# EasyEDA Pro project EMG_frontend.eprj, board PCB1
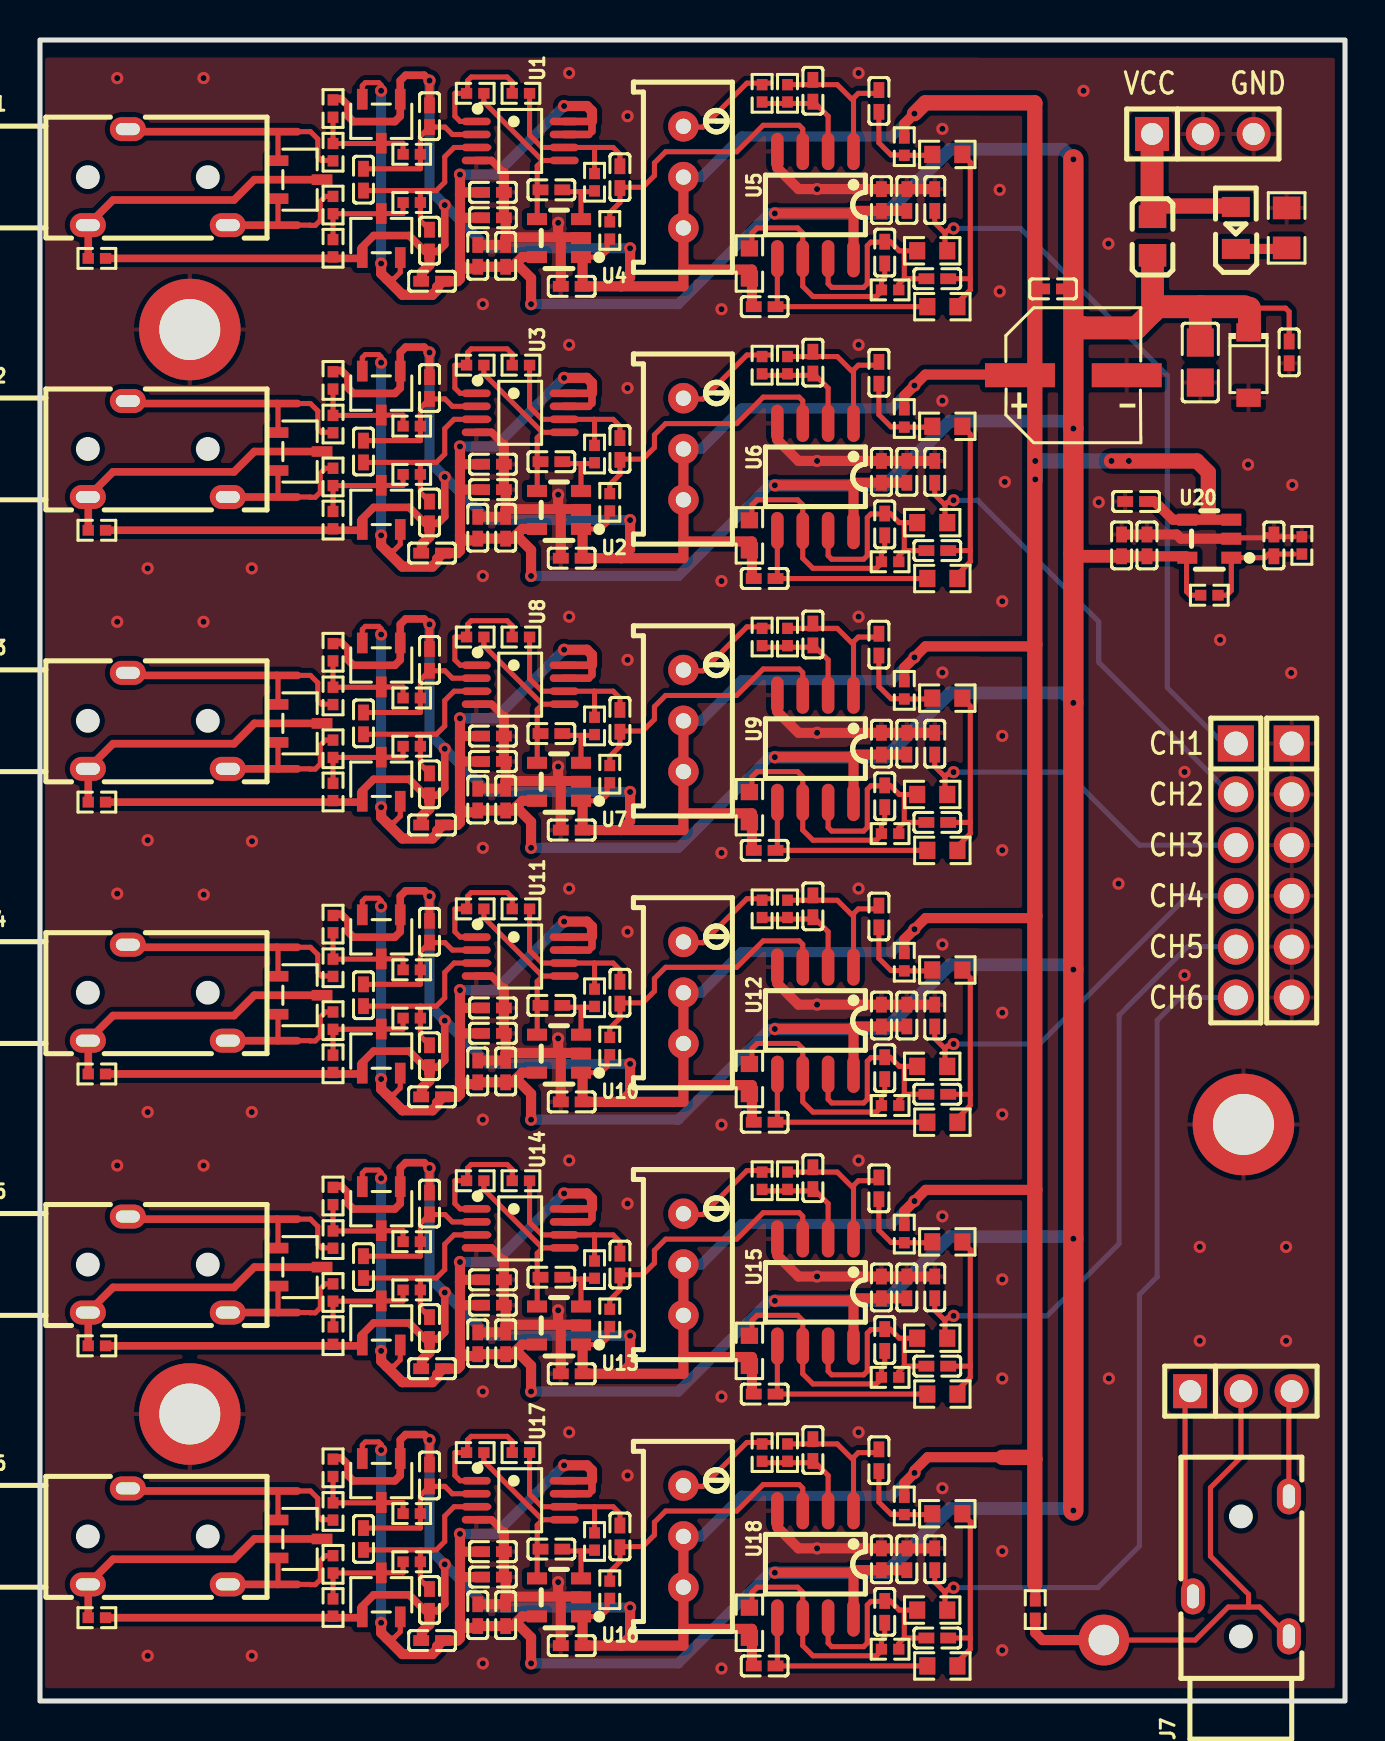
[diagram p2: board, top side]
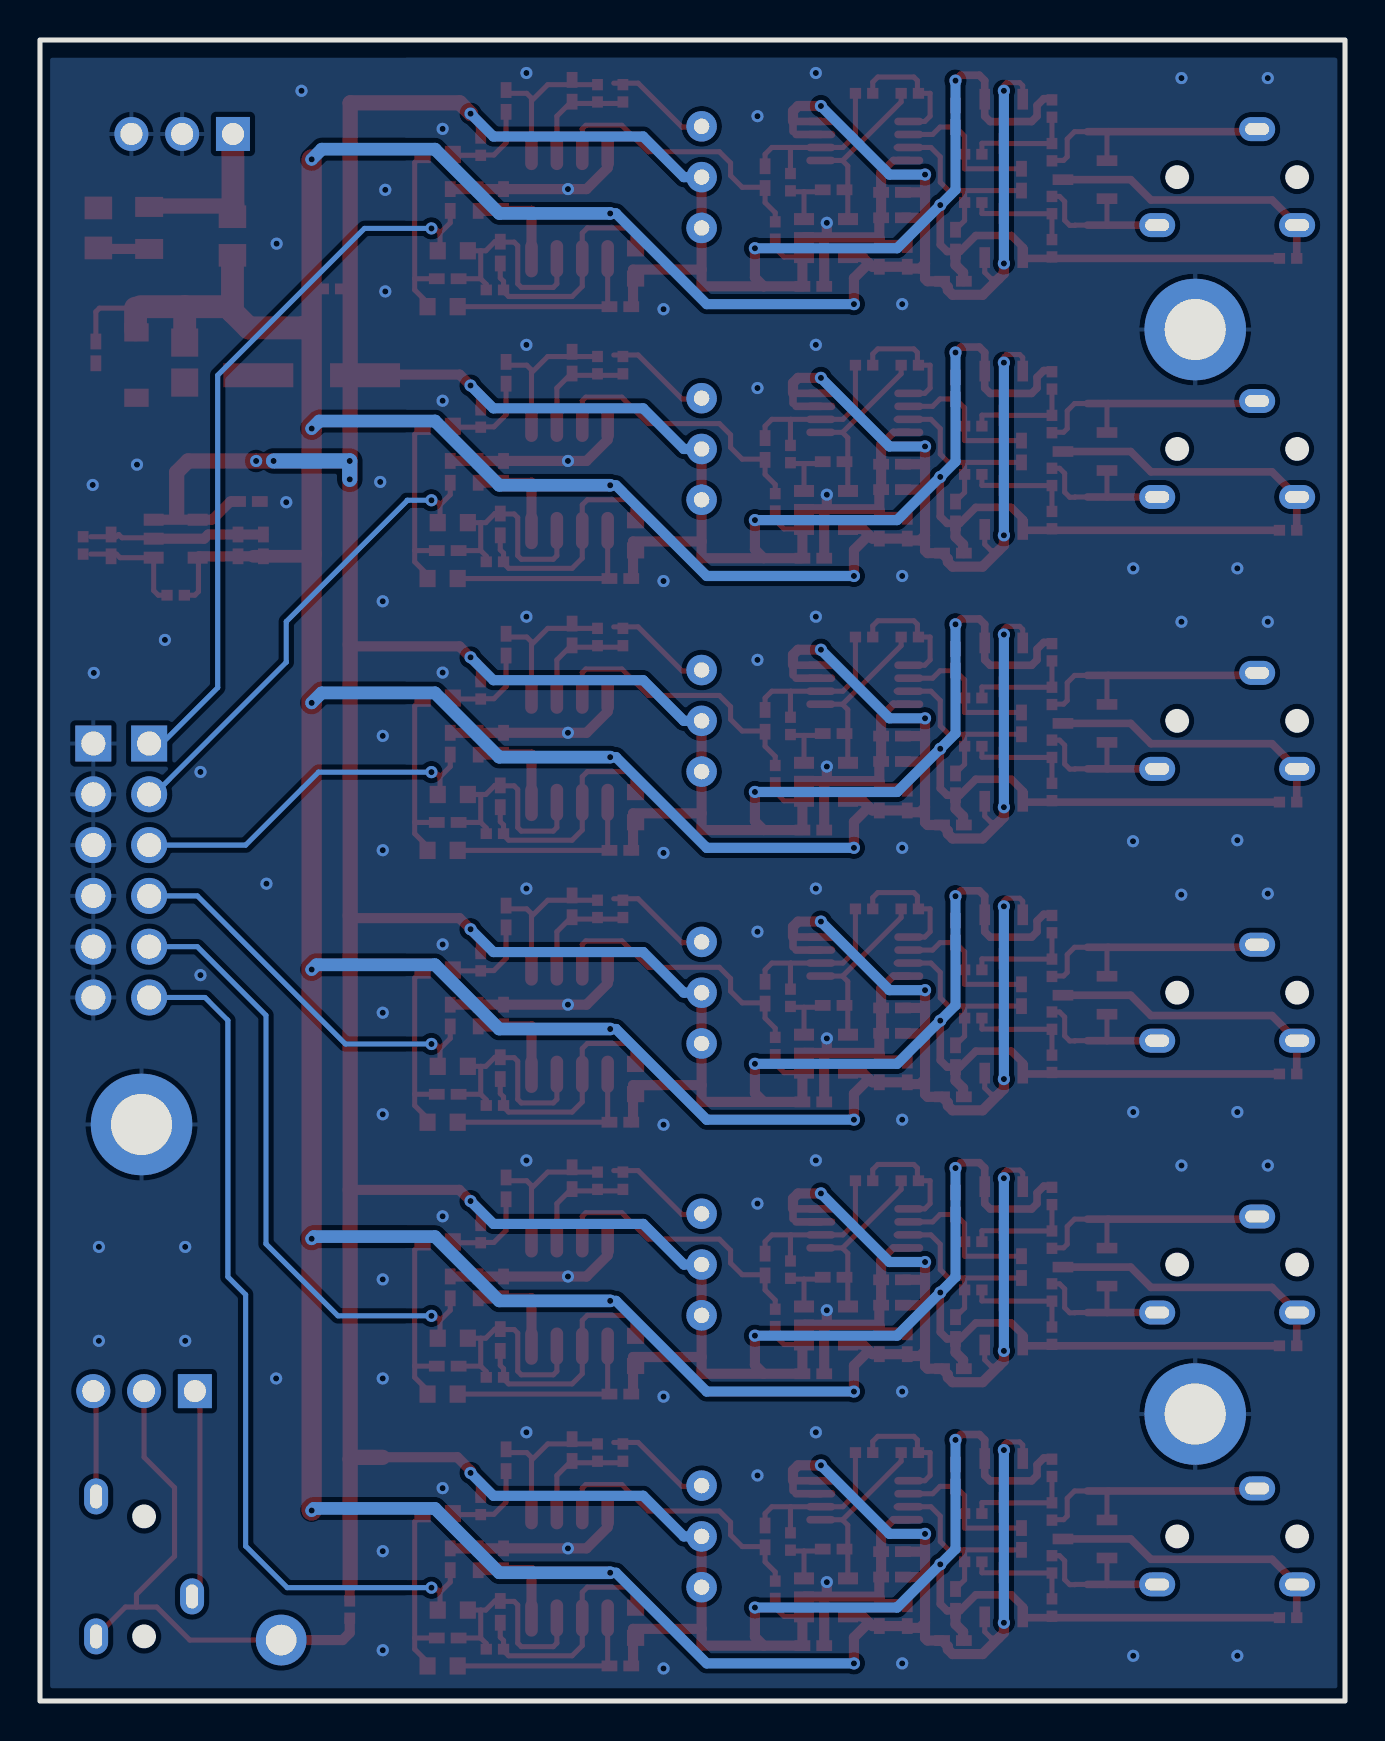
[diagram p3: board, bottom side, seen from below]

Outline 65.28 x 83.06 mm; copper layers: Top Layer, Bottom Layer. Coordinates in mm from the lower left corner of the outline.
Outline path: rectangle 0,83.06 65.28,0
Stack: Top Layer 0.035mm / Dielectric1 1.51mm FR4 er 4.5 / Bottom Layer 0.035mm

## Design rules (mm)
template: JLCPCB Capability(Two Layers Board)
spacing copperThickness1oz (default): track to track 0.102, other pairs 0.152 to 0.3
spacing copperThickness2oz: track to track 0.203, other pairs 0.152 to 0.3
track width copperThickness1oz (default): min 0.127, default 0.254, max 2.54
track width copperThickness2oz: min 0.203, default 0.254, max 2.54
differential pair differentialPair (default): width min 0.127, default 0.254, max 2.54; gap min 0.152, default 0.152
via viaSize (default): diameter min 0.5, default 0.61, max 10; hole min 0.3, default 0.305, max 6.3

## Placement (name value [footprint] x y rotation side)
C1  1uF  [C0402]  25.58 75.57 0 top
C2  1uF  [C0402]  22.66 74.17 0 top
C3  100nF  [C0402]  22.66 75.44 0 top
C4  1uF  [C0402]  23.29 72.26 90 top
C5  100nF  [C0402]  21.9 72.26 90 top
C6  1uF  [C0402]  29.01 76.2 270 top
C7  1uF  [C0402]  41.96 80.01 270 top
C8  1nF  [C0402]  38.66 80.52 90 top
C9  1uF  [C0402]  42.09 75.06 90 top
C10  100nF  [C0402]  43.36 75.06 90 top
C11  10nF  [C0402]  44.88 71.12 180 top
C12  10nF  [C0402]  36.25 69.72 0 top
C13  1nF  [C0402]  42.25 72.43 90 top
C14  1uF  [C0402]  44.76 75.06 270 top
C15  10nF  [C0402]  16.18 76.07 90 top
C16  100pF  [C0402]  19.48 73.03 270 top
C17  100pF  [C0402]  19.48 79.25 270 top
C18  100nF  [C0402]  26.6 70.74 0 top
C19  100nF  [C0402]  19.61 70.99 180 top
C20  1uF  [C0402]  25.58 61.97 0 top
C21  1uF  [C0402]  23.29 58.67 90 top
C22  100nF  [C0402]  21.9 58.67 90 top
C23  1uF  [C0402]  41.96 66.42 270 top
C24  100nF  [C0402]  22.66 61.84 0 top
C25  1uF  [C0402]  22.66 60.57 0 top
C26  1uF  [C0402]  29.01 62.61 270 top
C27  1nF  [C0402]  38.66 66.92 90 top
C28  1uF  [C0402]  42.09 61.46 90 top
C29  100nF  [C0402]  43.36 61.46 90 top
C30  10nF  [C0402]  44.88 57.53 180 top
C31  10nF  [C0402]  36.25 56.13 0 top
C32  1nF  [C0402]  42.25 58.83 90 top
C33  1uF  [C0402]  44.76 61.46 270 top
C34  10nF  [C0402]  16.18 62.48 90 top
C35  100pF  [C0402]  19.48 59.43 270 top
C36  100pF  [C0402]  19.48 65.65 270 top
C37  100nF  [C0402]  26.6 57.15 0 top
C38  100nF  [C0402]  19.61 57.4 180 top
C39  1uF  [C0402]  25.58 48.38 0 top
C40  1uF  [C0402]  23.29 45.08 90 top
C41  100nF  [C0402]  21.9 45.08 90 top
C42  1uF  [C0402]  41.96 52.82 270 top
C43  100nF  [C0402]  22.66 48.25 0 top
C44  1uF  [C0402]  22.66 46.98 0 top
C45  1uF  [C0402]  29.01 49.01 270 top
C46  1nF  [C0402]  38.66 53.33 90 top
C47  1uF  [C0402]  42.09 47.87 90 top
C48  100nF  [C0402]  43.36 47.87 90 top
C49  10nF  [C0402]  44.88 43.93 180 top
C50  10nF  [C0402]  36.25 42.54 0 top
C51  1nF  [C0402]  42.25 45.24 90 top
C52  1uF  [C0402]  44.76 47.87 270 top
C53  10nF  [C0402]  16.18 48.89 90 top
C54  100pF  [C0402]  19.48 45.84 270 top
C55  100pF  [C0402]  19.48 52.06 270 top
C56  100nF  [C0402]  26.6 43.55 0 top
C57  100nF  [C0402]  19.61 43.81 180 top
C58  1uF  [C0402]  25.58 34.78 0 top
C59  1uF  [C0402]  23.29 31.48 90 top
C60  100nF  [C0402]  21.9 31.48 90 top
C61  1uF  [C0402]  41.96 39.23 270 top
C62  100nF  [C0402]  22.66 34.66 0 top
C63  1uF  [C0402]  22.66 33.39 0 top
C64  1uF  [C0402]  29.01 35.42 270 top
C65  1nF  [C0402]  38.66 39.74 90 top
C66  1uF  [C0402]  42.09 34.28 90 top
C67  100nF  [C0402]  43.36 34.28 90 top
C68  10nF  [C0402]  44.88 30.34 180 top
C69  10nF  [C0402]  36.25 28.94 0 top
C70  1nF  [C0402]  42.25 31.65 90 top
C71  1uF  [C0402]  44.76 34.28 270 top
C72  10nF  [C0402]  16.18 35.29 90 top
C73  100pF  [C0402]  19.48 32.24 270 top
C74  100pF  [C0402]  19.48 38.47 270 top
C75  100nF  [C0402]  26.6 29.96 0 top
C76  100nF  [C0402]  19.61 30.21 180 top
C77  1uF  [C0402]  25.58 21.19 0 top
C78  1uF  [C0402]  23.29 17.89 90 top
C79  100nF  [C0402]  21.9 17.89 90 top
C80  1uF  [C0402]  41.96 25.63 270 top
C81  100nF  [C0402]  22.66 21.06 0 top
C82  1uF  [C0402]  22.66 19.79 0 top
C83  1uF  [C0402]  29.01 21.82 270 top
C84  1nF  [C0402]  38.66 26.14 90 top
C85  1uF  [C0402]  42.09 20.68 90 top
C86  100nF  [C0402]  43.36 20.68 90 top
C87  10nF  [C0402]  44.88 16.74 180 top
C88  10nF  [C0402]  36.25 15.35 0 top
C89  1nF  [C0402]  42.25 18.05 90 top
C90  1uF  [C0402]  44.76 20.68 270 top
C91  10nF  [C0402]  16.18 21.7 90 top
C92  100pF  [C0402]  19.48 18.65 270 top
C93  100pF  [C0402]  19.48 24.87 270 top
C94  100nF  [C0402]  26.6 16.36 0 top
C95  100nF  [C0402]  19.61 16.62 180 top
C96  1uF  [C0402]  25.58 7.59 0 top
C97  1uF  [C0402]  23.29 4.29 90 top
C98  100nF  [C0402]  21.9 4.29 90 top
C99  1uF  [C0402]  41.96 12.04 270 top
C100  100nF  [C0402]  22.66 7.47 0 top
C101  1uF  [C0402]  22.66 6.2 0 top
C102  1uF  [C0402]  29.01 8.23 270 top
C103  1nF  [C0402]  38.66 12.55 90 top
C104  1uF  [C0402]  42.09 7.09 90 top
C105  100nF  [C0402]  43.36 7.09 90 top
C106  10nF  [C0402]  44.88 3.15 180 top
C107  10nF  [C0402]  36.25 1.75 0 top
C108  1nF  [C0402]  42.25 4.46 90 top
C109  1uF  [C0402]  44.76 7.09 270 top
C110  10nF  [C0402]  16.18 8.1 90 top
C111  100pF  [C0402]  19.48 5.05 270 top
C112  100pF  [C0402]  19.48 11.28 270 top
C113  100nF  [C0402]  26.6 2.77 0 top
C114  100nF  [C0402]  19.61 3.02 180 top
C116  1uF  [C0402]  55.37 57.78 90 top
C117  100nF  [C0402]  54.1 57.78 90 top
C119  100nF  [C0402]  50.67 70.61 0 top
C120  100nF  [C0402]  54.83 59.98 180 top
C121  47uF  [CAP-SMD_BD6.3-L6.6-W6.6-LS7.6-FD]  51.69 66.29 0 top
C122  10nF  [C0402]  61.72 57.78 270 top
C123  10uF  [C0805]  58.04 66.93 90 top
C124  100nF  [C0402]  62.48 67.44 90 top
D1  PSM712-LF-T7  [SOT-23-3_L3.0-W1.7-P0.95-LS2.9-BR]  13.01 76.07 180 top
D3  BAV70  [SOT-23-3_L3.0-W1.7-P0.95-LS2.9-BR]  17.07 78.99 90 top
D4  BAV70  [SOT-23-3_L3.0-W1.7-P0.95-LS2.9-BR]  17.07 73.28 270 top
D5  PSM712-LF-T7  [SOT-23-3_L3.0-W1.7-P0.95-LS2.9-BR]  13.01 62.48 180 top
D7  BAV70  [SOT-23-3_L3.0-W1.7-P0.95-LS2.9-BR]  17.07 65.4 90 top
D8  BAV70  [SOT-23-3_L3.0-W1.7-P0.95-LS2.9-BR]  17.07 59.69 270 top
D9  PSM712-LF-T7  [SOT-23-3_L3.0-W1.7-P0.95-LS2.9-BR]  13.01 48.89 180 top
D11  BAV70  [SOT-23-3_L3.0-W1.7-P0.95-LS2.9-BR]  17.07 51.81 90 top
D12  BAV70  [SOT-23-3_L3.0-W1.7-P0.95-LS2.9-BR]  17.07 46.09 270 top
D13  PSM712-LF-T7  [SOT-23-3_L3.0-W1.7-P0.95-LS2.9-BR]  13.01 35.29 180 top
D15  BAV70  [SOT-23-3_L3.0-W1.7-P0.95-LS2.9-BR]  17.07 38.21 90 top
D16  BAV70  [SOT-23-3_L3.0-W1.7-P0.95-LS2.9-BR]  17.07 32.5 270 top
D17  PSM712-LF-T7  [SOT-23-3_L3.0-W1.7-P0.95-LS2.9-BR]  13.01 21.7 180 top
D19  BAV70  [SOT-23-3_L3.0-W1.7-P0.95-LS2.9-BR]  17.07 24.62 90 top
D20  BAV70  [SOT-23-3_L3.0-W1.7-P0.95-LS2.9-BR]  17.07 18.9 270 top
D21  PSM712-LF-T7  [SOT-23-3_L3.0-W1.7-P0.95-LS2.9-BR]  13.01 8.1 180 top
D23  BAV70  [SOT-23-3_L3.0-W1.7-P0.95-LS2.9-BR]  17.07 11.02 90 top
D24  BAV70  [SOT-23-3_L3.0-W1.7-P0.95-LS2.9-BR]  17.07 5.31 270 top
H1  2.54-1x6P直针  [HDR-TH_6P-P2.54-V-M-1]  59.82 41.53 270 top
H2  2.54-1x6P直针  [HDR-TH_6P-P2.54-V-M-1]  62.61 41.53 270 top
H3  PZ254V-11-03P  [HDR-TH_3P-P2.54-V-M]  58.17 78.36 0 top
H4  PZ254V-11-03P  [HDR-TH_3P-P2.54-V-M]  60.07 15.49 0 top
J1  320B直插  [AUDIO-TH_PJ-3200]  5.9 76.2 0 top
J2  320B直插  [AUDIO-TH_PJ-3200]  5.9 62.61 0 top
J3  320B直插  [AUDIO-TH_PJ-3200]  5.9 49.01 0 top
J4  320B直插  [AUDIO-TH_PJ-3200]  5.9 35.42 0 top
J5  320B直插  [AUDIO-TH_PJ-3200]  5.9 21.82 0 top
J6  320B直插  [AUDIO-TH_PJ-3200]  5.9 8.23 0 top
J7  320B直插  [AUDIO-TH_PJ-3200]  60.07 6.73 90 top
L1  10uH  [L0805]  55.65 73.25 90 top
LED1  NCD0805R1  [LED0805-R-RD]  59.82 73.66 90 top
NOREF  -  [Pad_e625]  7.49 68.58 0 top
NOREF#2  -  [Pad_e620]  7.49 14.35 0 top
NOREF#3  -  [Pad_e358]  53.21 3.05 0 top
NOREF#4  -  [Pad_e411]  60.2 28.83 0 top
R1  10kΩ  [R0402]  21.77 80.39 0 top
R2  10kΩ  [R0402]  24.06 80.39 180 top
R3  100kΩ  [R0402]  27.74 75.95 90 top
R4  100kΩ  [R0402]  28.5 73.53 90 top
R5  100kΩ  [R0402]  43.23 77.72 270 top
R6  20kΩ  [RES-ADJ-TH_3P-L9.5-W4.85-P2.54_PV36W103C01B00]  32.18 76.2 0 top
R7  1kΩ  [R0402]  36.12 80.39 270 top
R8  100kΩ  [R0402]  37.39 80.39 90 top
R9  56kΩ  [R0603]  45.38 77.33 0 top
R10  330kΩ  [R0603]  45.14 69.72 180 top
R11  3.9kΩ  [R0603]  35.49 71.88 90 top
R12  10kΩ  [R0402]  42.52 70.56 180 top
R13  3.9kΩ  [R0603]  44.63 72.52 0 top
R14  100kΩ  [R0402]  27.74 62.35 90 top
R15  10kΩ  [R0402]  24.06 66.8 180 top
R16  100kΩ  [R0402]  43.23 64.13 270 top
R17  100kΩ  [R0402]  28.5 59.94 90 top
R18  10kΩ  [R0402]  21.77 66.8 0 top
R19  1MΩ  [R0402]  14.66 79.63 90 top
R20  1MΩ  [R0402]  14.66 72.64 90 top
R21  2kΩ  [R0402]  14.66 77.45 90 top
R22  2kΩ  [R0402]  2.85 72.14 0 top
R23  2kΩ  [R0402]  14.66 74.8 270 top
R24  2kΩ  [R0402]  18.59 74.93 0 top
R25  2kΩ  [R0402]  18.59 77.34 0 top
R26  20kΩ  [RES-ADJ-TH_3P-L9.5-W4.85-P2.54_PV36W103C01B00]  32.18 62.61 0 top
R27  1kΩ  [R0402]  36.12 66.8 270 top
R28  100kΩ  [R0402]  37.39 66.8 90 top
R29  56kΩ  [R0603]  45.38 63.74 0 top
R30  330kΩ  [R0603]  45.14 56.13 180 top
R31  3.9kΩ  [R0603]  35.49 58.29 90 top
R32  10kΩ  [R0402]  42.52 56.97 180 top
R33  3.9kΩ  [R0603]  44.63 58.92 0 top
R34  1MΩ  [R0402]  14.66 66.04 90 top
R35  1MΩ  [R0402]  14.66 59.05 90 top
R36  2kΩ  [R0402]  14.66 63.85 90 top
R37  2kΩ  [R0402]  2.85 58.54 0 top
R38  2kΩ  [R0402]  14.66 61.21 270 top
R39  2kΩ  [R0402]  18.59 61.34 0 top
R40  2kΩ  [R0402]  18.59 63.75 0 top
R41  100kΩ  [R0402]  27.74 48.76 90 top
R42  10kΩ  [R0402]  24.06 53.2 180 top
R43  100kΩ  [R0402]  43.23 50.54 270 top
R44  100kΩ  [R0402]  28.5 46.35 90 top
R45  10kΩ  [R0402]  21.77 53.2 0 top
R46  20kΩ  [RES-ADJ-TH_3P-L9.5-W4.85-P2.54_PV36W103C01B00]  32.18 49.01 0 top
R47  1kΩ  [R0402]  36.12 53.2 270 top
R48  100kΩ  [R0402]  37.39 53.2 90 top
R49  56kΩ  [R0603]  45.38 50.15 0 top
R50  330kΩ  [R0603]  45.14 42.54 180 top
R51  3.9kΩ  [R0603]  35.49 44.69 90 top
R52  10kΩ  [R0402]  42.52 43.37 180 top
R53  3.9kΩ  [R0603]  44.63 45.33 0 top
R54  1MΩ  [R0402]  14.66 52.44 90 top
R55  1MΩ  [R0402]  14.66 45.46 90 top
R56  2kΩ  [R0402]  14.66 50.26 90 top
R57  2kΩ  [R0402]  2.85 44.95 0 top
R58  2kΩ  [R0402]  14.66 47.62 270 top
R59  2kΩ  [R0402]  18.59 47.74 0 top
R60  2kΩ  [R0402]  18.59 50.16 0 top
R61  100kΩ  [R0402]  27.74 35.16 90 top
R62  10kΩ  [R0402]  24.06 39.61 180 top
R63  100kΩ  [R0402]  43.23 36.94 270 top
R64  100kΩ  [R0402]  28.5 32.75 90 top
R65  10kΩ  [R0402]  21.77 39.61 0 top
R66  20kΩ  [RES-ADJ-TH_3P-L9.5-W4.85-P2.54_PV36W103C01B00]  32.18 35.42 0 top
R67  1kΩ  [R0402]  36.12 39.61 270 top
R68  100kΩ  [R0402]  37.39 39.61 90 top
R69  56kΩ  [R0603]  45.38 36.55 0 top
R70  330kΩ  [R0603]  45.14 28.94 180 top
R71  3.9kΩ  [R0603]  35.49 31.1 90 top
R72  10kΩ  [R0402]  42.52 29.78 180 top
R73  3.9kΩ  [R0603]  44.63 31.74 0 top
R74  1MΩ  [R0402]  14.66 38.85 90 top
R75  1MΩ  [R0402]  14.66 31.86 90 top
R76  2kΩ  [R0402]  14.66 36.66 90 top
R77  2kΩ  [R0402]  2.85 31.35 0 top
R78  2kΩ  [R0402]  14.66 34.02 270 top
R79  2kΩ  [R0402]  18.59 34.15 0 top
R80  2kΩ  [R0402]  18.59 36.56 0 top
R81  100kΩ  [R0402]  27.74 21.57 90 top
R82  10kΩ  [R0402]  24.06 26.02 180 top
R83  100kΩ  [R0402]  43.23 23.35 270 top
R84  100kΩ  [R0402]  28.5 19.16 90 top
R85  10kΩ  [R0402]  21.77 26.02 0 top
R86  20kΩ  [RES-ADJ-TH_3P-L9.5-W4.85-P2.54_PV36W103C01B00]  32.18 21.82 0 top
R87  1kΩ  [R0402]  36.12 26.02 270 top
R88  100kΩ  [R0402]  37.39 26.02 90 top
R89  56kΩ  [R0603]  45.38 22.96 0 top
R90  330kΩ  [R0603]  45.14 15.35 180 top
R91  3.9kΩ  [R0603]  35.49 17.51 90 top
R92  10kΩ  [R0402]  42.52 16.18 180 top
R93  3.9kΩ  [R0603]  44.63 18.14 0 top
R94  1MΩ  [R0402]  14.66 25.25 90 top
R95  1MΩ  [R0402]  14.66 18.27 90 top
R96  2kΩ  [R0402]  14.66 23.07 90 top
R97  2kΩ  [R0402]  2.85 17.76 0 top
R98  2kΩ  [R0402]  14.66 20.43 270 top
R99  2kΩ  [R0402]  18.59 20.55 0 top
R100  2kΩ  [R0402]  18.59 22.97 0 top
R101  100kΩ  [R0402]  27.74 7.98 90 top
R102  10kΩ  [R0402]  24.06 12.42 180 top
R103  100kΩ  [R0402]  43.23 9.75 270 top
R104  100kΩ  [R0402]  28.5 5.56 90 top
R105  10kΩ  [R0402]  21.77 12.42 0 top
R106  20kΩ  [RES-ADJ-TH_3P-L9.5-W4.85-P2.54_PV36W103C01B00]  32.18 8.23 0 top
R107  1kΩ  [R0402]  36.12 12.42 270 top
R108  100kΩ  [R0402]  37.39 12.42 90 top
R109  56kΩ  [R0603]  45.38 9.36 0 top
R110  330kΩ  [R0603]  45.14 1.75 180 top
R111  3.9kΩ  [R0603]  35.49 3.91 90 top
R112  10kΩ  [R0402]  42.52 2.59 180 top
R113  3.9kΩ  [R0603]  44.63 4.55 0 top
R114  1MΩ  [R0402]  14.66 11.66 90 top
R115  1MΩ  [R0402]  14.66 4.67 90 top
R116  2kΩ  [R0402]  14.66 9.48 90 top
R117  2kΩ  [R0402]  2.85 4.17 0 top
R118  2kΩ  [R0402]  14.66 6.83 270 top
R119  2kΩ  [R0402]  18.59 6.96 0 top
R120  2kΩ  [R0402]  18.59 9.37 0 top
R121  10kΩ  [R0402]  58.49 55.3 0 top
R122  10kΩ  [R0402]  63.12 57.78 270 top
R123  8.2kΩ  [R0805]  62.36 73.66 270 top
R124  2kΩ  [R0402]  49.78 4.57 90 top
U1  INA331AIDGKT  [VSSOP-8_L3.0-W3.0-P0.65-LS4.9-BL]  24.02 78.01 270 top
U2  TPMCP6001UT-I/OT  [SOT-23-5_L2.9-W1.6-P0.95-LS2.8-BR]  25.96 59.56 0 top
U3  INA331AIDGKT  [VSSOP-8_L3.0-W3.0-P0.65-LS4.9-BL]  24.02 64.41 270 top
U4  TPMCP6001UT-I/OT  [SOT-23-5_L2.9-W1.6-P0.95-LS2.8-BR]  25.96 73.15 0 top
U5  MCP6002M/TR  [SOP-8_L4.9-W3.9-P1.27-LS6.0-BL]  38.79 74.8 180 top
U6  MCP6002M/TR  [SOP-8_L4.9-W3.9-P1.27-LS6.0-BL]  38.79 61.21 180 top
U7  TPMCP6001UT-I/OT  [SOT-23-5_L2.9-W1.6-P0.95-LS2.8-BR]  25.96 45.96 0 top
U8  INA331AIDGKT  [VSSOP-8_L3.0-W3.0-P0.65-LS4.9-BL]  24.02 50.82 270 top
U9  MCP6002M/TR  [SOP-8_L4.9-W3.9-P1.27-LS6.0-BL]  38.79 47.62 180 top
U10  TPMCP6001UT-I/OT  [SOT-23-5_L2.9-W1.6-P0.95-LS2.8-BR]  25.96 32.37 0 top
U11  INA331AIDGKT  [VSSOP-8_L3.0-W3.0-P0.65-LS4.9-BL]  24.02 37.23 270 top
U12  MCP6002M/TR  [SOP-8_L4.9-W3.9-P1.27-LS6.0-BL]  38.79 34.02 180 top
U13  TPMCP6001UT-I/OT  [SOT-23-5_L2.9-W1.6-P0.95-LS2.8-BR]  25.96 18.78 0 top
U14  INA331AIDGKT  [VSSOP-8_L3.0-W3.0-P0.65-LS4.9-BL]  24.02 23.63 270 top
U15  MCP6002M/TR  [SOP-8_L4.9-W3.9-P1.27-LS6.0-BL]  38.79 20.43 180 top
U16  TPMCP6001UT-I/OT  [SOT-23-5_L2.9-W1.6-P0.95-LS2.8-BR]  25.96 5.18 0 top
U17  INA331AIDGKT  [VSSOP-8_L3.0-W3.0-P0.65-LS4.9-BL]  24.02 10.04 270 top
U18  MCP6002M/TR  [SOP-8_L4.9-W3.9-P1.27-LS6.0-BL]  38.79 6.83 180 top
U20  TPMCP6001UT-I/OT  [SOT-23-5_L2.9-W1.6-P0.95-LS2.8-BR]  58.49 58.12 0 top
U21  BZT52C6V2  [SOD-123_L2.7-W1.6-LS3.7-RD]  60.45 66.8 270 top

## Footprints (pads in the part's own frame, mm; a bottom-side part is the same pattern mirrored in y, then rotated)
AUDIO-TH_PJ-3200
  oval 1.8x1.2 hole 1.2x0.6: 2(-1.5,2.4) 3(-3.5,-2.4) 4(3.5,-2.4)
C0402
  rect 0.79x0.54 smd: 1(-0.545,0) 2(0.545,0)
C0805
  rect 1.41x1.35 smd: 1(-1,0) 2(1,0)
CAP-SMD_BD6.3-L6.6-W6.6-LS7.6-FD
  rect 3.5x1.2 smd: 1(-2.67,0) 2(2.67,0)
HDR-TH_3P-P2.54-V-M
  rect 1.7x1.7 hole 1.1: 1(-2.54,0)
  round 1.7 hole 1.1: 2(0,0) 3(2.54,0)
HDR-TH_6P-P2.54-V-M-1
  rect 1.8x1.8 hole 1.2: 1(-6.35,0)
  round 1.8 hole 1.2: 2(-3.81,0) 3(-1.27,0) 4(1.27,0) 5(3.81,0) 6(6.35,0)
L0805
  rect 1.133x1.377 smd: 1(-0.966,0) 2(0.966,0)
LED0805-R-RD
  rect 1x1.399 smd: 1(1.05,0) 2(-1.05,0)
Pad_e358
  round 2.54 hole 1.524: 1(0,0)
Pad_e411
  round 5.08 hole 3.048: 1(0,0)
Pad_e620
  round 5.08 hole 3.048: 1(0,0)
Pad_e625
  round 5.08 hole 3.048: 1(0,0)
R0402
  rect 0.566x0.54 smd: 1(-0.433,0) 2(0.433,0)
R0603
  rect 0.806x0.864 smd: 1(-0.753,0) 2(0.753,0)
R0805
  rect 1.133x1.377 smd: 1(-1,0) 2(1,0)
RES-ADJ-TH_3P-L9.5-W4.85-P2.54_PV36W103C01B00
  round 1.524 hole 0.762: 1(0,2.54) 2(0,0) 3(0,-2.54)
SOD-123_L2.7-W1.6-LS3.7-RD
  rect 0.91x1.22 smd: 1(-1.635,0) 2(1.635,0)
SOP-8_L4.9-W3.9-P1.27-LS6.0-BL
  oval 0.63x1.865 smd: 1(-1.905,-2.683) 2(-0.635,-2.683) 3(0.635,-2.683) 4(1.905,-2.683) 5(1.905,2.683) 6(0.635,2.683) 7(-0.635,2.683) 8(-1.905,2.683)
SOT-23-3_L3.0-W1.7-P0.95-LS2.9-BR
  rect 1.038x0.532 smd: 1(1.101,-0.95) 2(1.101,0.95) 3(-1.101,0)
SOT-23-5_L2.9-W1.6-P0.95-LS2.8-BR
  rect 1x0.6 smd: 1(1.1,-0.95) 2(1.1,0) 3(1.1,0.95) 4(-1.1,0.95) 5(-1.1,-0.95)
VSSOP-8_L3.0-W3.0-P0.65-LS4.9-BL
  oval 0.38x1.45 smd: 1(-0.975,-2.2) 2(-0.325,-2.2) 3(0.325,-2.2) 4(0.975,-2.2) 5(0.975,2.2) 6(0.325,2.2) 7(-0.325,2.2) 8(-0.975,2.2)

## Nets
GND: C2.2 C3.2 C4.2 C5.2 C9.2 C10.2 C14.1 C18.1 C21.2 C22.2 C24.2 C25.2 C28.2 C29.2 C33.1 C37.1 C40.2 C41.2 C43.2 C44.2 C47.2 C48.2 C52.1 C56.1 C59.2 C60.2 C62.2 C63.2 C66.2 C67.2 C71.1 C75.1 C78.2 C79.2 C81.2 C82.2 C85.2 C86.2 C90.1 C94.1 C97.2 C98.2 C100.2 C101.2 C104.2 C105.2 C109.1 C113.1 C116.2 C117.2 C120.2 C121.2 C122.1 C123.1 C124.1 H2.1 H2.2 H2.3 H2.4 H2.5 H2.6 H3.2 H3.3 NOREF.1 NOREF#2.1 NOREF#4.1 R122.1 R123.1 U1.4 U2.2 U3.4 U4.2 U5.4 U6.4 U7.2 U8.4 U9.4 U10.2 U11.4 U12.4 U13.2 U14.4 U15.4 U16.2 U17.4 U18.4 U20.2 U21.2
VCC: C2.1 C3.1 C4.1 C5.1 C9.1 C10.1 C19.1 C21.1 C22.1 C24.1 C25.1 C28.1 C29.1 C38.1 C40.1 C41.1 C43.1 C44.1 C47.1 C48.1 C57.1 C59.1 C60.1 C62.1 C63.1 C66.1 C67.1 C76.1 C78.1 C79.1 C81.1 C82.1 C85.1 C86.1 C95.1 C97.1 C98.1 C100.1 C101.1 C104.1 C105.1 C114.1 C116.1 C117.1 C119.2 C123.2 C124.2 D3.2 D4.2 D7.2 D8.2 D11.2 D12.2 D15.2 D16.2 D19.2 D20.2 D23.2 D24.2 L1.1 R121.1 U1.7 U1.8 U2.5 U3.7 U3.8 U4.5 U5.8 U6.8 U7.5 U8.7 U8.8 U9.8 U10.5 U11.7 U11.8 U12.8 U13.5 U14.7 U14.8 U15.8 U16.5 U17.7 U17.8 U18.8 U20.5 U21.1
$5I3605\$1N782: C1.2 R3.1 U4.3
$5I3605\$1N800: C1.1 R1.2 U1.5 U4.4
$5I3605\$1N816: R1.1 R2.2 U1.1
$5I3605\$1N2150: R6.1 R7.1
$5I3605\$1N2207: C8.1 R7.2 R8.1 U5.2
$5I3605\$1N2765: C12.2 R10.2 U5.5
$5I3605\$1N2767: C11.1 R9.2 R10.1
$5I3605\$1N3046: C13.1 R11.2 R12.2 U5.6
$5I3605\$1N3779: D3.3 R19.1 R21.2 R25.1
$5I3605\$1N3785: D4.3 R20.2 R23.2 R24.1
$5I3605\C: D1.3 J1.3 R22.1
$5I3605\IN+: C15.1 C16.1 R24.2 U1.3
$5I3605\IN-: C15.2 C17.2 R25.2 U1.2
$5I3605\L: D1.2 J1.4 R23.1
$5I3605\OUT1: C6.1 R2.1 R3.2 U1.6
$5I3605\OUT1_HP: C6.2 R4.2 U5.3
$5I3605\OUT2: C7.1 C8.2 R8.2 U5.1
$5I3605\OUT2_HP: C7.2 R5.2 R9.1
$5I3605\OUT3: C11.2 C13.2 R12.1 R13.1 U5.7
$5I3605\R: D1.1 J1.2 R21.1
$5I3619\$1N782: C20.2 R14.1 U2.3
$5I3619\$1N800: C20.1 R18.2 U2.4 U3.5
$5I3619\$1N816: R15.2 R18.1 U3.1
$5I3619\$1N2150: R26.1 R27.1
$5I3619\$1N2207: C27.1 R27.2 R28.1 U6.2
$5I3619\$1N2765: C31.2 R30.2 U6.5
$5I3619\$1N2767: C30.1 R29.2 R30.1
$5I3619\$1N3046: C32.1 R31.2 R32.2 U6.6
$5I3619\$1N3779: D7.3 R34.1 R36.2 R40.1
$5I3619\$1N3785: D8.3 R35.2 R38.2 R39.1
$5I3619\C: D5.3 J2.3 R37.1
$5I3619\IN+: C34.1 C35.1 R39.2 U3.3
$5I3619\IN-: C34.2 C36.2 R40.2 U3.2
$5I3619\L: D5.2 J2.4 R38.1
$5I3619\OUT1: C26.1 R14.2 R15.1 U3.6
$5I3619\OUT1_HP: C26.2 R17.2 U6.3
$5I3619\OUT2: C23.1 C27.2 R28.2 U6.1
$5I3619\OUT2_HP: C23.2 R16.2 R29.1
$5I3619\OUT3: C30.2 C32.2 R32.1 R33.1 U6.7
$5I3619\R: D5.1 J2.2 R36.1
$5I3633\$1N782: C39.2 R41.1 U7.3
$5I3633\$1N800: C39.1 R45.2 U7.4 U8.5
$5I3633\$1N816: R42.2 R45.1 U8.1
$5I3633\$1N2150: R46.1 R47.1
$5I3633\$1N2207: C46.1 R47.2 R48.1 U9.2
$5I3633\$1N2765: C50.2 R50.2 U9.5
$5I3633\$1N2767: C49.1 R49.2 R50.1
$5I3633\$1N3046: C51.1 R51.2 R52.2 U9.6
$5I3633\$1N3779: D11.3 R54.1 R56.2 R60.1
$5I3633\$1N3785: D12.3 R55.2 R58.2 R59.1
$5I3633\C: D9.3 J3.3 R57.1
$5I3633\IN+: C53.1 C54.1 R59.2 U8.3
$5I3633\IN-: C53.2 C55.2 R60.2 U8.2
$5I3633\L: D9.2 J3.4 R58.1
$5I3633\OUT1: C45.1 R41.2 R42.1 U8.6
$5I3633\OUT1_HP: C45.2 R44.2 U9.3
$5I3633\OUT2: C42.1 C46.2 R48.2 U9.1
$5I3633\OUT2_HP: C42.2 R43.2 R49.1
$5I3633\OUT3: C49.2 C51.2 R52.1 R53.1 U9.7
$5I3633\R: D9.1 J3.2 R56.1
$5I3647\$1N782: C58.2 R61.1 U10.3
$5I3647\$1N800: C58.1 R65.2 U10.4 U11.5
$5I3647\$1N816: R62.2 R65.1 U11.1
$5I3647\$1N2150: R66.1 R67.1
$5I3647\$1N2207: C65.1 R67.2 R68.1 U12.2
$5I3647\$1N2765: C69.2 R70.2 U12.5
$5I3647\$1N2767: C68.1 R69.2 R70.1
$5I3647\$1N3046: C70.1 R71.2 R72.2 U12.6
$5I3647\$1N3779: D15.3 R74.1 R76.2 R80.1
$5I3647\$1N3785: D16.3 R75.2 R78.2 R79.1
$5I3647\C: D13.3 J4.3 R77.1
$5I3647\IN+: C72.1 C73.1 R79.2 U11.3
$5I3647\IN-: C72.2 C74.2 R80.2 U11.2
$5I3647\L: D13.2 J4.4 R78.1
$5I3647\OUT1: C64.1 R61.2 R62.1 U11.6
$5I3647\OUT1_HP: C64.2 R64.2 U12.3
$5I3647\OUT2: C61.1 C65.2 R68.2 U12.1
$5I3647\OUT2_HP: C61.2 R63.2 R69.1
$5I3647\OUT3: C68.2 C70.2 R72.1 R73.1 U12.7
$5I3647\R: D13.1 J4.2 R76.1
$5I3661\$1N782: C77.2 R81.1 U13.3
$5I3661\$1N800: C77.1 R85.2 U13.4 U14.5
$5I3661\$1N816: R82.2 R85.1 U14.1
$5I3661\$1N2150: R86.1 R87.1
$5I3661\$1N2207: C84.1 R87.2 R88.1 U15.2
$5I3661\$1N2765: C88.2 R90.2 U15.5
$5I3661\$1N2767: C87.1 R89.2 R90.1
$5I3661\$1N3046: C89.1 R91.2 R92.2 U15.6
$5I3661\$1N3779: D19.3 R94.1 R96.2 R100.1
$5I3661\$1N3785: D20.3 R95.2 R98.2 R99.1
$5I3661\C: D17.3 J5.3 R97.1
$5I3661\IN+: C91.1 C92.1 R99.2 U14.3
$5I3661\IN-: C91.2 C93.2 R100.2 U14.2
$5I3661\L: D17.2 J5.4 R98.1
$5I3661\OUT1: C83.1 R81.2 R82.1 U14.6
$5I3661\OUT1_HP: C83.2 R84.2 U15.3
$5I3661\OUT2: C80.1 C84.2 R88.2 U15.1
$5I3661\OUT2_HP: C80.2 R83.2 R89.1
$5I3661\OUT3: C87.2 C89.2 R92.1 R93.1 U15.7
$5I3661\R: D17.1 J5.2 R96.1
$5I3675\$1N782: C96.2 R101.1 U16.3
$5I3675\$1N800: C96.1 R105.2 U16.4 U17.5
$5I3675\$1N816: R102.2 R105.1 U17.1
$5I3675\$1N2150: R106.1 R107.1
$5I3675\$1N2207: C103.1 R107.2 R108.1 U18.2
$5I3675\$1N2765: C107.2 R110.2 U18.5
$5I3675\$1N2767: C106.1 R109.2 R110.1
$5I3675\$1N3046: C108.1 R111.2 R112.2 U18.6
$5I3675\$1N3779: D23.3 R114.1 R116.2 R120.1
$5I3675\$1N3785: D24.3 R115.2 R118.2 R119.1
$5I3675\C: D21.3 J6.3 R117.1
$5I3675\IN+: C110.1 C111.1 R119.2 U17.3
$5I3675\IN-: C110.2 C112.2 R120.2 U17.2
$5I3675\L: D21.2 J6.4 R118.1
$5I3675\OUT1: C102.1 R101.2 R102.1 U17.6
$5I3675\OUT1_HP: C102.2 R104.2 U18.3
$5I3675\OUT2: C99.1 C103.2 R108.2 U18.1
$5I3675\OUT2_HP: C99.2 R103.2 R109.1
$5I3675\OUT3: C106.2 C108.2 R112.1 R113.1 U18.7
$5I3675\R: D21.1 J6.2 R116.1
VREF: C12.1 C16.2 C17.1 C18.2 C19.2 C31.1 C35.2 C36.1 C37.2 C38.2 C50.1 C54.2 C55.1 C56.2 C57.2 C69.1 C73.2 C74.1 C75.2 C76.2 C88.1 C92.2 C93.1 C94.2 C95.2 C107.1 C111.2 C112.1 C113.2 C114.2 C119.1 C120.1 C121.1 D3.1 D4.1 D7.1 D8.1 D11.1 D12.1 D15.1 D16.1 D19.1 D20.1 D23.1 D24.1 R4.1 R5.1 R6.2 R6.3 R11.1 R16.1 R17.1 R19.2 R20.1 R22.2 R26.2 R26.3 R31.1 R34.2 R35.1 R37.2 R43.1 R44.1 R46.2 R46.3 R51.1 R54.2 R55.1 R57.2 R63.1 R64.1 R66.2 R66.3 R71.1 R74.2 R75.1 R77.2 R83.1 R84.1 R86.2 R86.3 R91.1 R94.2 R95.1 R97.2 R103.1 R104.1 R106.2 R106.3 R111.1 R114.2 R115.1 R117.2 R124.2 U2.1 U4.1 U7.1 U10.1 U13.1 U16.1 U20.3 U20.4
VREF_PAD: H4.2 J7.3 NOREF#3.1 R124.1
$5N672: C122.2 R121.2 R122.2 U20.1
$5N676: H3.1 L1.2 LED1.1
$5N679: C14.2 H1.1 R13.2
$5N680: C33.2 H1.2 R33.2
$5N681: C52.2 H1.3 R53.2
$5N683: C71.2 H1.4 R73.2
$5N684: C90.2 H1.5 R93.2
$5N1514: LED1.2 R123.2
$5N3892: C109.2 H1.6 R113.2
$5N6446: H4.1 J7.2
$5N6450: H4.3 J7.4

## Via types
v1: diameter 0.61, hole 0.305, Top Layer to Bottom Layer, 167 vias

## Routing (per net, layer and track width the routed paths; a pad name or vN(x,y) marks a point on that pad's centre or on a via; arc(x,y) is an arc through that point)
GND: length 145
  Top Layer w0.254: 62.74,58.22 61.45,58.22 61.34,58.33 61.18,58.17 59.64,58.17
  Top Layer w0.381: U11.4 22.59,36.25 23.2,35.64 ; 21.82,63.44 22.59,63.44 23.2,62.82 ; 23.2,22.04 22.59,22.66 U14.4 ; 23.2,49.23 22.59,49.85 21.82,49.85 ; U17.4 22.59,9.06 23.2,8.45 ; 23.2,76.42 22.59,77.03 U1.4
  Top Layer w0.508: U7.2 27.02,46 26.05,46 ; 23.29,59.6 26.05,59.6 ; 23.29,59.6 C21.2 C22.2 ; 23.29,59.6 23.29,60.48 C25.2 C24.2 23.2,62.82 ; 26.05,59.6 26.05,59.59 26.05,57.27 ; 26.05,59.6 25.92,59.72 v1(25.92,60.32) ; 26.05,59.6 27.02,59.6 U2.2 ; v1(25.92,73.91) 25.92,73.32 26.05,73.19 ; v1(25.92,46.73) 25.92,46.13 26.05,46 ; 23.29,46 23.29,46.89 C44.2 C43.2 23.2,49.23 ; 23.29,46 C40.2 C41.2 ; 23.29,46 26.05,46 ; 23.29,18.81 26.05,18.81 ; 23.29,18.81 23.29,19.7 C82.2 C81.2 23.2,22.04 ; 23.29,18.81 C78.2 C79.2 ; 26.05,18.81 26.05,18.81 26.05,16.49 ; 26.05,18.81 25.92,18.94 v1(25.92,19.54) ; 26.05,18.81 27.02,18.81 27.06,18.78 ; U20.2 57.07,58.12 56.86,58.33 C117.2 ; C33.1 C29.2 C28.2 v1(38.87,62.01) 37.94,62.01 36.88,63.07 U6.4 ; 23.29,73.19 26.05,73.19 ; 23.29,73.19 C4.2 C5.2 ; 23.29,73.19 23.29,74.08 C2.2 C3.2 23.2,76.42 ; 26.05,73.19 26.05,73.18 26.05,70.87 ; 26.05,73.19 27.02,73.19 U4.2 ; 23.29,32.41 23.29,33.3 C63.2 C62.2 23.2,35.64 ; 23.29,32.41 C59.2 C60.2 ; 23.29,32.41 26.05,32.41 ; U15.4 36.88,22.28 37.94,21.23 v1(38.87,21.23) C85.2 C86.2 C90.1 ; 26.05,46 26.05,46 26.05,43.68 ; 23.2,8.45 C100.2 C101.2 23.29,6.11 23.29,5.22 ; 26.05,5.22 27.02,5.22 U16.2 ; 26.05,5.22 23.29,5.22 ; 26.05,5.22 25.92,5.35 v1(25.92,5.94) ; 26.05,5.22 26.05,5.21 26.05,2.9 ; 23.29,5.22 23.29,4.84 21.9,4.84 ; U10.2 27.02,32.41 26.05,32.41 ; U12.4 36.88,35.88 37.94,34.82 v1(38.87,34.82) C66.2 C67.2 C71.1 ; 26.05,32.41 25.92,32.53 v1(25.92,33.13) ; 26.05,32.41 26.05,32.4 26.05,30.08 ; 44.76,7.63 v1(38.87,7.63) 37.94,7.63 36.88,8.69 U18.4 ; U5.4 36.88,76.66 37.94,75.6 v1(38.87,75.6) C9.2 C10.2 C14.1 ; U9.4 36.88,49.47 37.94,48.41 v1(38.87,48.41) C47.2 C48.2 C52.1
  vias: v1(3.86,81.15) v1(3.86,53.97) v1(3.86,40.37) v1(3.86,26.78) v1(5.39,56.64) v1(5.39,43.04) v1(5.39,29.45) v1(5.39,2.26) v1(8.18,81.15) v1(8.18,53.97) v1(8.19,40.32) v1(8.18,26.78) v1(10.59,56.64) v1(10.6,42.99) v1(10.59,29.45) v1(10.59,2.26) v1(22.15,69.85) v1(22.15,56.26) v1(22.15,42.66) v1(22.15,29.07) v1(22.15,15.47) v1(22.15,1.88) v1(26.47,81.41) v1(26.47,67.81) v1(26.47,54.22) v1(26.47,40.63) v1(26.47,27.03) v1(26.47,13.44) v1(29.39,79.25) v1(29.39,65.65) v1(29.39,52.06) v1(29.39,38.47) v1(29.39,24.87) v1(29.39,11.28) v1(34.09,69.6) v1(34.09,56) v1(34.09,42.41) v1(34.09,28.81) v1(34.09,15.22) v1(34.09,1.63) v1(40.95,81.41) v1(40.95,67.81) v1(40.95,54.22) v1(40.95,40.63) v1(40.95,27.03) v1(40.95,13.44) v1(45.14,78.61) v1(45.14,65.02) v1(45.14,51.43) v1(45.14,37.83) v1(45.14,24.24) v1(45.14,10.64) v1(48.01,75.56) v1(48.01,70.48) v1(48.13,54.99) v1(48.13,48.26) v1(48.13,42.54) v1(48.13,34.42) v1(48.13,29.34) v1(48.13,21.08) v1(48.13,16.13) v1(48.13,7.49) v1(48.13,2.54) v1(48.26,60.96) v1(52.2,80.52) v1(52.96,59.94) v1(53.44,72.87) v1(53.47,16.13) v1(53.95,40.87) v1(57.25,46.46) v1(57.25,36.3) v1(58.01,22.71) v1(58.01,18.01) v1(59.03,53.06) v1(60.43,61.82) v1(62.33,22.71) v1(62.33,18.01) v1(62.64,60.81) v1(62.59,51.41)
VCC: length 590.9
  Top Layer w0.254: v1(17.06,80.52) 17.06,80.81 16.94,80.92 16.27,80.92 16.12,80.77 D3.2 ; D7.2 16.12,67.18 16.27,67.33 16.94,67.33 17.06,67.21 v1(17.06,66.92) ; D8.2 18.02,57.84 17.71,57.53 17.21,57.53 ; v1(17.06,53.33) 17.06,53.62 16.94,53.74 16.27,53.74 16.12,53.58 D11.2 ; 16.12,39.31 16.12,39.99 16.27,40.14 16.94,40.14 17.06,40.02 v1(17.06,39.74) ; D23.2 16.12,12.8 16.27,12.95 16.94,12.95 17.06,12.84 v1(17.06,12.55) ; D24.2 18.02,3.47 17.71,3.15 17.21,3.15 ; C124.2 62.48,69.47 62.3,69.65 60.5,69.65 ; 17.21,43.93 17.71,43.93 18.02,44.25 D12.2 ; R121.1 57.53,55.3 57.35,55.47 57.35,57.13 U20.5 ; D19.2 16.12,26.4 16.27,26.55 16.94,26.55 17.06,26.43 v1(17.06,26.14) ; 17.21,30.34 17.71,30.34 18.02,30.65 D16.2 ; 60.25,69.72 60.32,69.65 ; D4.2 18.02,71.44 17.71,71.12 17.21,71.12 ; D20.2 18.02,17.06 17.71,16.74 17.21,16.74
  Top Layer w0.381: U17.8 27.6,11.01 27.61,11.02 27.61,10.52 ; 26.22,51.15 27.46,51.15 ; U3.7 27.46,64.74 ; 27.61,51.3 27.61,51.81 27.6,51.8 U8.8 ; U3.8 27.6,65.39 27.61,65.4 27.61,64.89 ; 27.61,37.7 27.61,38.21 27.6,38.2 26.22,38.2 ; U11.7 27.46,37.55 ; 27.61,24.11 27.61,24.62 27.6,24.61 U14.8 ; 26.22,78.98 27.6,78.98 27.61,78.99 27.61,78.49 ; U17.7 27.46,10.36 ; U1.7 27.46,78.33 ; U14.7 27.46,23.96
  Top Layer w0.508: 23.82,3.93 23.64,3.75 C97.1 C98.1 21.81,3.66 21.26,3.66 21.01,3.91 ; 23.82,3.93 24.56,3.18 v1(24.56,1.88) ; 23.82,3.93 24.12,4.23 U16.5 ; v1(17.06,31.1) 17.06,30.6 18.13,29.54 19.63,29.54 19.87,29.77 19.87,29.92 C76.1 20.88,30.21 21.01,30.34 21.01,31.1 ; C67.1 C66.1 40.69,33.73 ; v1(26.22,79.76) 27.36,79.76 27.61,79.5 27.61,78.99 ; v1(36.76,33.6) 40.57,33.6 40.69,33.73 ; 40.69,47.32 C47.1 C48.1 ; 40.69,47.32 40.57,47.2 v1(36.76,47.2) ; 40.69,47.32 U9.8 ; 27.61,24.62 27.61,25.13 27.36,25.38 v1(26.22,25.38) ; 23.82,71.9 24.56,71.15 v1(24.56,69.85) ; 23.82,71.9 24.12,72.2 U4.5 ; 23.82,71.9 23.64,71.72 C4.1 C5.1 21.81,71.63 21.26,71.63 21.01,71.88 ; 23.82,44.71 24.12,45.01 U7.5 ; 23.82,44.71 24.56,43.96 v1(24.56,42.66) ; 23.82,44.71 23.64,44.53 C40.1 C41.1 21.81,44.44 21.26,44.44 21.01,44.69 ; 40.69,33.73 U12.8 ; v1(17.06,71.88) 17.06,71.38 18.13,70.32 19.63,70.32 19.87,70.56 19.87,70.7 C19.1 20.88,70.99 21.01,71.12 21.01,71.88 ; 21.01,71.88 21.01,74.18 ; 21.01,74.18 21.01,75.34 ; 21.01,74.18 21.02,74.17 22.11,74.17 ; 21.01,7.37 21.01,6.2 ; 21.01,7.37 v1(21.01,8.36) ; 21.01,7.37 21.11,7.47 22.11,7.47 ; 21.01,6.2 21.02,6.2 22.11,6.2 ; 21.01,6.2 21.01,3.91 ; 27.61,65.4 27.61,65.91 27.36,66.16 v1(26.22,66.16) ; 23.82,58.3 24.12,58.61 U2.5 ; 23.82,58.3 23.64,58.12 C21.1 C22.1 21.81,58.03 21.26,58.03 21.01,58.29 ; 23.82,58.3 24.56,57.55 v1(24.56,56.26) ; 40.69,20.14 43.36,20.14 ; 40.69,20.14 U15.8 ; 40.69,20.14 40.57,20.01 v1(36.76,20.01) ; 54.61,57.24 57.32,57.24 U20.5 ; 23.82,31.11 23.64,30.94 C59.1 C60.1 21.81,30.85 21.26,30.85 21.01,31.1 ; 23.82,31.11 24.12,31.42 U10.5 ; 23.82,31.11 24.56,30.37 v1(24.56,29.07) ; 21.01,60.58 21.02,60.57 22.11,60.57 ; 21.01,60.58 21.01,58.29 ; 21.01,60.58 21.01,61.74 ; v1(17.06,58.29) 17.06,57.79 18.13,56.72 19.63,56.72 19.87,56.96 19.87,57.11 C38.1 20.88,57.4 21.01,57.53 21.01,58.29 ; 21.01,33.39 21.02,33.39 22.11,33.39 ; 21.01,33.39 21.01,31.1 ; 21.01,33.39 21.01,34.55 ; 40.69,74.51 C9.1 C10.1 ; 40.69,74.51 40.57,74.39 v1(36.76,74.39) ; 40.69,74.51 U5.8 ; v1(26.22,52.57) 27.36,52.57 27.61,52.31 27.61,51.81 ; 21.01,17.51 21.01,16.74 20.88,16.62 C95.1 19.87,16.33 19.87,16.18 19.63,15.94 18.13,15.94 17.06,17.01 v1(17.06,17.51) ; 21.01,17.51 21.01,19.8 ; 21.01,17.51 21.26,17.25 21.81,17.25 C79.1 C78.1 23.64,17.34 23.82,17.52 ; 23.82,17.52 24.56,16.77 v1(24.56,15.47) ; 23.82,17.52 24.12,17.83 U13.5 ; 21.01,19.8 21.02,19.79 22.11,19.79 ; 21.01,19.8 21.01,20.96 ; v1(21.01,76.33) 21.01,75.34 ; 21.01,75.34 21.11,75.44 22.11,75.44 ; C105.1 C104.1 40.69,6.54 ; v1(36.76,60.79) 40.57,60.79 40.69,60.92 ; 21.01,44.69 21.01,46.99 ; 21.01,44.69 21.01,43.93 20.88,43.81 C57.1 19.87,43.52 19.87,43.37 19.63,43.13 18.13,43.13 17.06,44.19 v1(17.06,44.69) ; 21.01,46.99 21.02,46.98 22.11,46.98 ; 21.01,46.99 21.01,48.15 ; v1(21.01,62.73) 21.01,61.74 ; 21.01,61.74 21.11,61.84 22.11,61.84 ; 22.11,21.06 21.11,21.06 21.01,20.96 ; v1(21.01,35.55) 21.01,34.55 ; 21.01,34.55 21.11,34.66 22.11,34.66 ; v1(26.22,11.79) 27.36,11.79 27.61,11.53 27.61,11.02 ; 40.69,6.54 U18.8 ; 40.69,6.54 40.57,6.41 v1(36.76,6.41) ; 40.69,60.92 C28.1 C29.1 ; 40.69,60.92 U6.8 ; v1(21.01,21.95) 21.01,20.96 ; v1(26.22,38.97) 27.36,38.97 27.61,38.72 27.61,38.21 ; 21.01,3.91 21.01,3.15 20.88,3.02 C114.1 19.87,2.73 19.87,2.58 19.63,2.35 18.13,2.35 17.33,3.15 17.06,3.41 v1(17.06,3.91) ; 22.11,48.25 21.11,48.25 21.01,48.15 ; v1(21.01,49.14) 21.01,48.15
  Top Layer w0.635: 54.61,57.24 51.81,57.24 51.69,57.36
  Top Layer w1.016: v1(51.69,77.09) v1(51.69,63.63) v1(51.69,49.91) v1(51.69,36.58) v1(51.69,23.11) v1(51.69,9.52)
  Top Layer w1.143: 55.65,71.75 55.65,69.47 ; 55.65,69.47 55.9,69.72 58.04,69.72 ; 55.65,69.47 54.84,68.66 52.12,68.66 52.07,68.71 ; 58.04,69.72 C123.2 ; 58.04,69.72 60.25,69.72 ; 60.5,69.65 60.5,68.56
  Bottom Layer w0.508: v1(17.06,53.33) v1(17.06,44.69) ; v1(36.76,33.6) 36.47,33.6 31.93,29.07 v1(24.56,29.07) ; v1(17.06,66.92) v1(17.06,58.29) ; v1(26.22,11.79) 22.79,8.36 v1(21.01,8.36) ; v1(26.22,52.57) 22.79,49.14 v1(21.01,49.14) ; v1(36.76,6.41) 36.47,6.41 31.93,1.88 v1(24.56,1.88) ; v1(36.76,74.39) 36.47,74.39 31.93,69.85 v1(24.56,69.85) ; v1(21.01,21.95) 22.79,21.95 v1(26.22,25.38) ; v1(21.01,62.73) 22.79,62.73 v1(26.22,66.16) ; v1(26.22,38.97) 22.79,35.55 v1(21.01,35.55) ; v1(17.06,80.52) v1(17.06,71.88) ; v1(24.56,42.66) 31.93,42.66 36.47,47.2 v1(36.76,47.2) ; v1(24.56,15.47) 31.93,15.47 36.47,20.01 v1(36.76,20.01) ; v1(17.06,39.74) v1(17.06,31.1) ; v1(26.22,79.76) 22.79,76.33 v1(21.01,76.33) ; v1(17.06,12.55) v1(17.06,3.91) ; v1(17.06,26.14) v1(17.06,17.51) ; v1(24.56,56.26) 31.93,56.26 36.47,60.79 v1(36.76,60.79)
  Bottom Layer w0.635: v1(36.76,33.6) 42.31,33.6 45.52,36.82 51.45,36.82 v1(51.69,36.58) ; v1(51.69,23.11) 51.58,23.22 45.52,23.22 42.31,20.01 v1(36.76,20.01) ; v1(36.76,47.2) 42.31,47.2 45.52,50.41 51.19,50.41 v1(51.69,49.91) ; v1(36.76,60.79) 42.31,60.79 45.52,64 51.31,64 v1(51.69,63.63) ; v1(51.69,9.52) 51.59,9.63 45.52,9.63 42.31,6.41 v1(36.76,6.41) ; v1(36.76,74.39) 42.31,74.39 45.52,77.6 51.18,77.6 v1(51.69,77.09)
$5I3605\$1N782: length 3
  Top Layer w0.254: 27.06,75.47 26.22,75.47 C1.2 ; 27.06,75.47 27.7,75.47 27.74,75.51 ; 27.06,75.47 U4.3
$5I3605\$1N800: length 8.7
  Top Layer w0.254: U1.5 25.13,77.03 ; 25.13,77.03 25.13,77.02 24.87,76.76 24.87,74.09 U4.4 ; 25.13,77.03 22.2,79.96 R1.2
$5I3605\$1N816: length 6.5
  Top Layer w0.254: 21.82,78.98 21.02,78.98 20.75,79.25 20.75,80.39 R1.1 21.39,80.44 21.39,81.03 21.57,81.21 23.37,81.21 23.62,80.95 R2.2
$5I3605\$1N2150: length 5.2
  Top Layer w0.254: 32.31,78.7 33.16,78.7 35.36,80.9 36.58,80.9
$5I3605\$1N2207: length 4.9
  Top Layer w0.254: 36.26,79.88 38.79,79.88 39.42,79.25 39.42,77.74
$5I3605\$1N2765: length 9.9
  Top Layer w0.254: U5.5 36.88,69.72 R10.2
$5I3605\$1N2767: length 9
  Top Layer w0.254: 46.53,71.13 46.53,70.56 45.95,69.98 45.95,69.85 ; 46.53,71.13 46.53,76.94 R9.2 ; 46.53,71.13 46.53,71.12 C11.1
$5I3605\$1N3046: length 12.1
  Top Layer w0.254: 35.61,72.44 35.61,73.41 35.87,73.66 37.9,73.66 38.15,73.41 U5.6 38.15,70.74 38.66,70.23 41.84,70.23 42.09,70.49 R12.2 42.09,70.99 42.25,71.16 C13.1
$5I3605\$1N3779: length 5.3
  Top Layer w0.254: 16.96,77.88 14.66,77.88 R19.1 ; D3.3 18.16,77.89 18.16,77.34
$5I3605\$1N3785: length 5.2
  Top Layer w0.254: 18.16,74.93 18.16,74.38 D4.3 ; 16.93,74.37 R23.2 R20.2
$5I3605\C: length 14.3
  Top Layer w0.381: 2.41,72.14 2.41,73.78 J1.3 3.65,75.06 9.71,75.06 10.72,76.07 D1.3
$5I3605\IN+: length 10.1
  Top Layer w0.254: 22.46,77.68 20.71,77.68 20.25,77.22 20.25,75.95 19.83,75.53 19.03,75.53 ; 19.03,75.53 19.03,74.03 C16.1 ; 19.03,75.53 C15.1
$5I3605\IN-: length 7.6
  Top Layer w0.254: U1.2 20.63,78.33 20.26,78.7 C17.2 19.03,78.25 19.03,77.34 19.03,76.62 C15.2
$5I3605\L: length 7.9
  Top Layer w0.254: D1.2 11.91,73.81 11.9,73.8 ; 12.88,73.8 13.5,73.8 13.52,73.79 13.77,73.79 14.02,74.04 14.02,74.98 14.28,75.24 R23.1
  Top Layer w0.381: 9.27,73.8 12.88,73.8
$5I3605\OUT1: length 8.9
  Top Layer w0.254: R2.1 24.49,78.31 25.11,77.68 U1.6 27.72,77.68 ; 27.72,77.68 28.67,77.68 29.01,77.34 C6.1 ; 27.72,77.68 27.74,77.67 R3.2
$5I3605\OUT1_HP: length 13.9
  Top Layer w0.254: U5.3 38.15,78.61 37.97,78.79 36.17,78.79 34.85,77.47 31.3,77.47 30.73,76.91 30.73,76.27 30.15,75.69 29.05,75.69 C6.2 29.01,74.93 28.5,74.42 R4.2
$5I3605\OUT2: length 7.5
  Top Layer w0.254: C7.1 41.8,80.39 40.93,80.39 40.69,80.15 40.69,80.01 ; 40.69,77.74 40.69,80.01 ; 40.69,80.01 39.88,80.82 R8.2
$5I3605\OUT2_HP: length 4.5
  Top Layer w0.254: C7.2 41.96,77.92 42.57,77.31 43.22,77.31 R5.2 44.59,77.29 R9.1
$5I3605\OUT3: length 11.1
  Top Layer w0.254: 43.23,71.12 42.96,70.84 42.96,70.56 ; 43.23,71.12 43.23,72.52 ; 43.23,71.12 C11.2 ; 43.23,72.52 42.98,72.52 42.52,72.97 C13.2 ; 43.23,72.52 R13.1 ; 42.13,72.97 42.11,72.95 41.56,72.95 41.38,72.77 41.38,70.87 41.2,70.69 39.6,70.69 39.42,70.87 U5.7
$5I3605\R: length 13
  Top Layer w0.254: R21.1 14.64,77.04 14.08,77.04 13.9,77.22 13.9,78.11 13.53,78.47 12.88,78.47 ; D1.1 11.91,78.41 11.85,78.47
  Top Layer w0.381: 4.27,78.6 4.4,78.47 12.88,78.47
$5I3619\$1N782: length 3
  Top Layer w0.254: U2.3 27.06,61.88 ; 27.06,61.88 26.22,61.88 C20.2 ; 27.06,61.88 27.7,61.88 R14.1
$5I3619\$1N800: length 8.7
  Top Layer w0.254: 25.13,63.44 25.13,63.42 24.87,63.17 24.87,60.5 U2.4 ; 25.13,63.44 22.2,66.36 R18.2 ; 25.13,63.44 26.22,63.44
$5I3619\$1N816: length 6.5
  Top Layer w0.254: R15.2 23.62,67.36 23.37,67.61 21.57,67.61 21.39,67.43 21.39,66.85 R18.1 20.75,66.8 20.75,65.65 21.02,65.39 U3.1
$5I3619\$1N2150: length 5.2
  Top Layer w0.254: 36.58,67.31 35.36,67.31 33.16,65.11 32.31,65.11
$5I3619\$1N2207: length 4.9
  Top Layer w0.254: 39.42,64.15 39.42,65.65 38.79,66.29 36.26,66.29
$5I3619\$1N2765: length 9.9
  Top Layer w0.254: R30.2 36.88,56.13 U6.5
$5I3619\$1N2767: length 9
  Top Layer w0.254: 45.95,56.26 45.95,56.38 46.53,56.97 46.53,57.54 ; 46.53,57.54 46.53,57.53 C30.1 ; 46.53,57.54 46.53,63.34 R29.2
$5I3619\$1N3046: length 12.1
  Top Layer w0.254: 35.61,58.85 35.61,59.81 35.87,60.07 37.9,60.07 38.15,59.81 U6.6 38.15,57.15 38.66,56.64 41.84,56.64 42.09,56.89 R32.2 42.09,57.4 42.25,57.56 C32.1
$5I3619\$1N3779: length 5.3
  Top Layer w0.254: 16.96,64.29 R36.2 R34.1 ; 18.16,63.75 18.16,64.3 D7.3
$5I3619\$1N3785: length 5.2
  Top Layer w0.254: 18.16,61.34 18.16,60.79 D8.3 ; R35.2 R38.2 16.93,60.78
$5I3619\C: length 14.3
  Top Layer w0.381: 2.41,58.54 2.41,60.19 J2.3 3.65,61.46 9.71,61.46 10.72,62.48 D5.3
$5I3619\IN+: length 10.1
  Top Layer w0.254: 22.46,64.09 20.71,64.09 20.25,63.62 20.25,62.35 19.83,61.93 19.03,61.93 ; 19.03,61.93 19.03,60.43 C35.1 ; 19.03,61.93 C34.1
$5I3619\IN-: length 7.6
  Top Layer w0.254: C34.2 19.03,63.02 19.03,63.75 19.03,64.65 C36.2 20.26,65.11 20.63,64.74 U3.2
$5I3619\L: length 7.9
  Top Layer w0.254: 11.9,60.21 11.91,60.21 D5.2 ; 12.88,60.21 13.5,60.21 13.52,60.19 13.77,60.19 14.02,60.45 14.02,61.39 14.28,61.64 R38.1
  Top Layer w0.381: 12.88,60.21 9.27,60.21
$5I3619\OUT1: length 8.9
  Top Layer w0.254: R15.1 24.49,64.71 25.11,64.09 U3.6 27.72,64.09 ; 27.72,64.09 28.67,64.09 29.01,63.75 C26.1 ; 27.72,64.09 27.74,64.07 R14.2
$5I3619\OUT1_HP: length 13.9
  Top Layer w0.254: U6.3 38.15,65.02 37.97,65.2 36.17,65.2 34.85,63.88 31.3,63.88 30.73,63.32 30.73,62.68 30.15,62.1 29.05,62.1 C26.2 29.01,61.34 28.5,60.83 R17.2
$5I3619\OUT2: length 7.5
  Top Layer w0.254: 40.69,66.42 39.88,67.23 R28.2 ; 40.69,66.42 40.69,64.15 ; 40.69,66.42 40.69,66.56 40.93,66.8 41.8,66.8 C23.1
$5I3619\OUT2_HP: length 4.5
  Top Layer w0.254: C23.2 41.96,64.32 42.57,63.71 43.22,63.71 R16.2 44.59,63.7 R29.1
$5I3619\OUT3: length 11.1
  Top Layer w0.254: R33.1 43.23,58.92 ; 43.23,58.92 43.23,57.53 ; 43.23,58.92 42.98,58.92 42.52,59.38 C32.2 ; 42.96,56.97 42.96,57.25 43.23,57.53 ; U6.7 39.42,57.27 39.6,57.09 41.2,57.09 41.38,57.27 41.38,59.18 41.56,59.36 42.11,59.36 42.13,59.38 ; 43.23,57.53 C30.2
$5I3619\R: length 13
  Top Layer w0.254: 11.85,64.88 11.91,64.82 D5.1 ; 12.88,64.88 13.53,64.88 13.9,64.51 13.9,63.62 14.08,63.44 14.64,63.44 14.66,63.42
  Top Layer w0.381: 4.27,65.01 4.4,64.88 12.88,64.88
$5I3633\$1N782: length 3
  Top Layer w0.254: 27.06,48.28 26.22,48.28 C39.2 ; 27.06,48.28 U7.3 ; 27.06,48.28 27.7,48.28 R41.1
$5I3633\$1N800: length 8.7
  Top Layer w0.254: U7.4 24.87,46.9 24.87,49.57 25.13,49.83 25.13,49.85 ; R45.2 22.2,52.77 25.13,49.85 ; 25.13,49.85 26.22,49.85
$5I3633\$1N816: length 6.5
  Top Layer w0.254: R42.2 23.62,53.76 23.37,54.02 21.57,54.02 21.39,53.84 21.39,53.26 R45.1 20.75,53.2 20.75,52.06 21.02,51.8 U8.1
$5I3633\$1N2150: length 5.2
  Top Layer w0.254: 32.31,51.51 33.16,51.51 35.36,53.71 36.58,53.71
$5I3633\$1N2207: length 4.9
  Top Layer w0.254: 36.26,52.7 38.79,52.7 39.42,52.06 39.42,50.55
$5I3633\$1N2765: length 9.9
  Top Layer w0.254: U9.5 36.88,42.54 R50.2
$5I3633\$1N2767: length 9
  Top Layer w0.254: 46.53,43.94 46.53,43.93 C49.1 ; 46.53,43.94 46.53,49.75 R49.2 ; 46.53,43.94 46.53,43.37 45.95,42.79 45.95,42.66
$5I3633\$1N3046: length 12.1
  Top Layer w0.254: C51.1 42.25,43.97 42.09,43.81 R52.2 42.09,43.3 41.84,43.04 38.66,43.04 38.15,43.55 U9.6 38.15,46.22 37.9,46.47 35.87,46.47 35.61,46.22 35.61,45.25
$5I3633\$1N3779: length 5.3
  Top Layer w0.254: 16.96,50.69 R56.2 R54.1 ; 18.16,50.16 18.16,50.7 D11.3
$5I3633\$1N3785: length 5.2
  Top Layer w0.254: 18.16,47.74 18.16,47.19 D12.3 ; R55.2 R58.2 16.93,47.18
$5I3633\C: length 14.3
  Top Layer w0.381: D9.3 10.72,48.89 9.71,47.87 3.65,47.87 J3.3 2.41,46.59 2.41,44.95
$5I3633\IN+: length 10.1
  Top Layer w0.254: C53.1 19.03,48.34 ; 19.03,48.34 19.03,46.84 C54.1 ; 19.03,48.34 19.83,48.34 20.25,48.76 20.25,50.03 20.71,50.5 22.46,50.5
$5I3633\IN-: length 7.6
  Top Layer w0.254: 21.82,51.15 20.63,51.15 20.26,51.52 C55.2 19.03,51.06 19.03,50.16 19.03,49.43 C53.2
$5I3633\L: length 7.9
  Top Layer w0.254: 11.9,46.61 11.91,46.62 D9.2 ; 12.88,46.61 13.5,46.61 13.52,46.6 13.77,46.6 14.02,46.85 14.02,47.79 14.28,48.05 R58.1
  Top Layer w0.381: 9.27,46.61 12.88,46.61
$5I3633\OUT1: length 8.9
  Top Layer w0.254: R42.1 24.49,51.12 25.11,50.5 U8.6 27.72,50.5 ; 27.72,50.5 27.74,50.48 R41.2 ; 27.72,50.5 28.67,50.5 29.01,50.16 C45.1
$5I3633\OUT1_HP: length 13.9
  Top Layer w0.254: R44.2 28.5,47.23 29.01,47.74 C45.2 29.05,48.5 30.15,48.5 30.73,49.09 30.73,49.72 31.3,50.28 34.85,50.28 36.17,51.6 37.97,51.6 38.15,51.43 U9.3
$5I3633\OUT2: length 7.5
  Top Layer w0.254: 40.69,52.82 39.88,53.64 R48.2 ; 40.69,52.82 40.69,52.96 40.93,53.2 41.8,53.2 C42.1 ; 40.69,52.82 40.69,50.55
$5I3633\OUT2_HP: length 4.5
  Top Layer w0.254: R49.1 44.59,50.1 R43.2 43.22,50.12 42.57,50.12 41.96,50.73 C42.2
$5I3633\OUT3: length 11.1
  Top Layer w0.254: R53.1 43.23,45.33 ; 43.23,45.33 42.98,45.33 42.52,45.78 C51.2 ; 43.23,45.33 43.23,43.93 ; 43.23,43.93 42.96,43.65 42.96,43.37 ; 43.23,43.93 C49.2 ; U9.7 39.42,43.68 39.6,43.5 41.2,43.5 41.38,43.68 41.38,45.58 41.56,45.76 42.11,45.76 42.13,45.78
$5I3633\R: length 13
  Top Layer w0.254: 11.85,51.28 11.91,51.22 D9.1 ; 14.66,49.83 14.64,49.85 14.08,49.85 13.9,50.03 13.9,50.92 13.53,51.28 12.88,51.28
  Top Layer w0.381: 12.88,51.28 4.4,51.28 4.27,51.41
$5I3647\$1N782: length 3
  Top Layer w0.254: R61.1 27.7,34.69 27.06,34.69 ; 27.06,34.69 26.22,34.69 C58.2 ; 27.06,34.69 27.06,33.32
$5I3647\$1N800: length 8.7
  Top Layer w0.254: R65.2 22.2,39.18 25.13,36.25 ; U11.5 25.13,36.25 ; 25.13,36.25 25.13,36.24 24.87,35.98 24.87,33.31 U10.4
$5I3647\$1N816: length 6.5
  Top Layer w0.254: 21.82,38.2 21.02,38.2 20.75,38.47 20.75,39.61 R65.1 21.39,39.66 21.39,40.24 21.57,40.42 23.37,40.42 23.62,40.17 R62.2
$5I3647\$1N2150: length 5.2
  Top Layer w0.254: 32.31,37.92 33.16,37.92 35.36,40.12 36.58,40.12
$5I3647\$1N2207: length 4.9
  Top Layer w0.254: 36.26,39.1 38.79,39.1 39.42,38.47 39.42,36.96
$5I3647\$1N2765: length 9.9
  Top Layer w0.254: R70.2 36.88,28.94 U12.5
$5I3647\$1N2767: length 9
  Top Layer w0.254: 45.95,29.07 45.95,29.2 46.53,29.78 46.53,30.35 ; 46.53,30.35 46.53,36.15 R69.2 ; 46.53,30.35 46.53,30.34 C68.1
$5I3647\$1N3046: length 12.1
  Top Layer w0.254: C70.1 42.25,30.38 42.09,30.21 R72.2 42.09,29.7 41.84,29.45 38.66,29.45 38.15,29.96 U12.6 38.15,32.62 37.9,32.88 35.87,32.88 35.61,32.62 35.61,31.66
$5I3647\$1N3779: length 5.3
  Top Layer w0.254: 18.16,36.56 18.16,37.11 D15.3 ; 16.96,37.1 R76.2 R74.1
$5I3647\$1N3785: length 5.2
  Top Layer w0.254: 16.93,33.59 R78.2 R75.2 ; 18.16,34.15 18.16,33.6 D16.3
$5I3647\C: length 14.3
  Top Layer w0.381: D13.3 10.72,35.29 9.71,34.28 3.65,34.28 J4.3 2.41,33 2.41,31.35
$5I3647\IN+: length 10.1
  Top Layer w0.254: 19.03,34.75 19.83,34.75 20.25,35.16 20.25,36.43 20.71,36.9 22.46,36.9 ; 19.03,34.75 C72.1 ; 19.03,34.75 19.03,33.24 C73.1
$5I3647\IN-: length 7.6
  Top Layer w0.254: C72.2 19.03,35.84 19.03,36.56 19.03,37.46 C74.2 20.26,37.92 20.63,37.55 U11.2
$5I3647\L: length 7.9
  Top Layer w0.254: R78.1 14.28,34.45 14.02,34.2 14.02,33.26 13.77,33.01 13.52,33.01 13.5,33.02 12.88,33.02 ; D13.2 11.91,33.03 11.9,33.02
  Top Layer w0.381: 12.88,33.02 9.27,33.02
$5I3647\OUT1: length 8.9
  Top Layer w0.254: 27.72,36.9 27.74,36.89 R61.2 ; 27.72,36.9 28.67,36.9 29.01,36.56 C64.1 ; 27.72,36.9 U11.6 25.11,36.9 24.49,37.53 R62.1
$5I3647\OUT1_HP: length 13.9
  Top Layer w0.254: U12.3 38.15,37.83 37.97,38.01 36.17,38.01 34.85,36.69 31.3,36.69 30.73,36.13 30.73,35.49 30.15,34.91 29.05,34.91 C64.2 29.01,34.15 28.5,33.64 28.5,33.18
$5I3647\OUT2: length 7.5
  Top Layer w0.254: 40.69,39.23 39.88,40.04 R68.2 ; 40.69,39.23 40.69,39.37 40.93,39.61 41.8,39.61 C61.1 ; 40.69,39.23 40.69,36.96
$5I3647\OUT2_HP: length 4.5
  Top Layer w0.254: R69.1 44.59,36.51 R63.2 43.22,36.52 42.57,36.52 41.96,37.13 C61.2
$5I3647\OUT3: length 11.1
  Top Layer w0.254: R73.1 43.23,31.74 ; 43.23,31.74 43.23,30.34 ; 43.23,31.74 42.98,31.74 42.52,32.19 C70.2 ; 42.96,29.78 42.96,30.06 43.23,30.34 ; 43.23,30.34 C68.2 ; 42.13,32.19 42.11,32.17 41.56,32.17 41.38,31.99 41.38,30.08 41.2,29.9 39.6,29.9 39.42,30.08 U12.7
$5I3647\R: length 13
  Top Layer w0.254: 11.85,37.69 11.91,37.63 D13.1 ; R76.1 14.64,36.25 14.08,36.25 13.9,36.43 13.9,37.32 13.53,37.69 12.88,37.69
  Top Layer w0.381: 4.27,37.82 4.4,37.69 12.88,37.69
$5I3661\$1N782: length 3
  Top Layer w0.254: 27.06,21.09 26.22,21.09 C77.2 ; 27.06,21.09 U13.3 ; 27.06,21.09 27.7,21.09 R81.1
$5I3661\$1N800: length 8.7
  Top Layer w0.254: U13.4 24.87,19.72 24.87,22.38 25.13,22.64 25.13,22.66 ; R85.2 22.2,25.58 25.13,22.66 ; 25.13,22.66 U14.5
$5I3661\$1N816: length 6.5
  Top Layer w0.254: U14.1 21.02,24.61 20.75,24.87 20.75,26.02 R85.1 21.39,26.07 21.39,26.65 21.57,26.83 23.37,26.83 23.62,26.57 R82.2
$5I3661\$1N2150: length 5.2
  Top Layer w0.254: 36.58,26.52 35.36,26.52 33.16,24.32 32.31,24.32
$5I3661\$1N2207: length 4.9
  Top Layer w0.254: 36.26,25.51 38.79,25.51 39.42,24.87 39.42,23.36
$5I3661\$1N2765: length 9.9
  Top Layer w0.254: U15.5 36.88,15.35 R90.2
$5I3661\$1N2767: length 9
  Top Layer w0.254: 46.53,16.75 46.53,16.74 C87.1 ; 46.53,16.75 46.53,16.18 45.95,15.6 45.95,15.47 ; 46.53,16.75 46.53,22.56 R89.2
$5I3661\$1N3046: length 12.1
  Top Layer w0.254: C89.1 42.25,16.78 42.09,16.62 R92.2 42.09,16.11 41.84,15.86 38.66,15.86 38.15,16.36 U15.6 38.15,19.03 37.9,19.28 35.87,19.28 35.61,19.03 35.61,18.07
$5I3661\$1N3779: length 5.3
  Top Layer w0.254: 16.96,23.5 R96.2 R94.1 ; D19.3 18.16,23.52 18.16,22.97
$5I3661\$1N3785: length 5.2
  Top Layer w0.254: 18.16,20.55 18.16,20 D20.3 ; R95.2 R98.2 16.93,19.99
$5I3661\C: length 14.3
  Top Layer w0.381: D17.3 10.72,21.7 9.71,20.68 3.65,20.68 J5.3 2.41,19.4 2.41,17.76
$5I3661\IN+: length 10.1
  Top Layer w0.254: C92.1 19.03,19.65 19.03,21.15 ; 22.46,23.31 20.71,23.31 20.25,22.84 20.25,21.57 19.83,21.15 19.03,21.15 ; 16.18,21.15 19.03,21.15
$5I3661\IN-: length 7.6
  Top Layer w0.254: C91.2 19.03,22.24 19.03,22.97 19.03,23.87 C93.2 20.26,24.33 20.63,23.96 U14.2
$5I3661\L: length 7.9
  Top Layer w0.254: 11.9,19.42 11.91,19.43 D17.2 ; 14.66,20.86 14.28,20.86 14.02,20.61 14.02,19.67 13.77,19.41 13.52,19.41 13.5,19.42 12.88,19.42
  Top Layer w0.381: 12.88,19.42 9.27,19.42
$5I3661\OUT1: length 8.9
  Top Layer w0.254: 27.72,23.31 U14.6 25.11,23.31 24.49,23.93 R82.1 ; 27.72,23.31 27.74,23.29 R81.2 ; 27.72,23.31 28.67,23.31 29.01,22.97 C83.1
$5I3661\OUT1_HP: length 13.9
  Top Layer w0.254: R84.2 28.5,20.05 29.01,20.55 C83.2 29.05,21.32 30.15,21.32 30.73,21.9 30.73,22.53 31.3,23.09 34.85,23.09 36.17,24.42 37.97,24.42 38.15,24.24 U15.3
$5I3661\OUT2: length 7.5
  Top Layer w0.254: 40.69,23.36 40.69,25.63 ; 40.69,25.63 40.69,25.78 40.93,26.02 41.8,26.02 C80.1 ; 40.69,25.63 39.88,26.45 37.39,26.45
$5I3661\OUT2_HP: length 4.5
  Top Layer w0.254: R89.1 44.59,22.92 R83.2 43.22,22.93 42.57,22.93 41.96,23.54 C80.2
$5I3661\OUT3: length 11.1
  Top Layer w0.254: U15.7 39.42,16.49 39.6,16.31 41.2,16.31 41.38,16.49 41.38,18.4 41.56,18.57 42.11,18.57 42.13,18.6 ; C89.2 42.52,18.6 42.98,18.14 43.23,18.14 ; 42.96,16.18 42.96,16.47 43.23,16.74 ; 43.23,16.74 C87.2 ; 43.23,16.74 43.23,18.14 ; R93.1 43.23,18.14
$5I3661\R: length 13
  Top Layer w0.254: 12.88,24.1 13.53,24.1 13.9,23.73 13.9,22.84 14.08,22.66 14.64,22.66 14.66,22.64 ; 11.85,24.1 11.91,24.04 D17.1
  Top Layer w0.381: 4.27,24.22 4.4,24.1 12.88,24.1
$5I3675\$1N782: length 3
  Top Layer w0.254: C96.2 26.22,7.5 27.06,7.5 ; 27.06,7.5 27.7,7.5 R101.1 ; 27.06,7.5 U16.3
$5I3675\$1N800: length 8.7
  Top Layer w0.254: U17.5 25.13,9.06 ; 25.13,9.06 22.2,11.99 R105.2 ; 25.13,9.06 25.13,9.05 24.87,8.79 24.87,6.12 24.86,6.13
$5I3675\$1N816: length 6.5
  Top Layer w0.254: U17.1 21.02,11.01 20.75,11.28 20.75,12.42 R105.1 21.39,12.47 21.39,13.06 21.57,13.24 23.37,13.24 23.62,12.98 R102.2
$5I3675\$1N2150: length 5.2
  Top Layer w0.254: 36.58,12.93 35.36,12.93 33.16,10.73 32.31,10.73
$5I3675\$1N2207: length 4.9
  Top Layer w0.254: 36.26,11.91 38.79,11.91 39.42,11.28 39.42,9.77
$5I3675\$1N2765: length 9.9
  Top Layer w0.254: U18.5 36.88,1.75 R110.2
$5I3675\$1N2767: length 9
  Top Layer w0.254: 45.95,1.88 45.95,2.01 46.53,2.59 46.53,3.16 ; C106.1 46.53,3.15 46.53,3.16 ; 46.53,3.16 46.53,8.97 R109.2
$5I3675\$1N3046: length 12.1
  Top Layer w0.254: 35.61,4.47 35.61,5.44 35.87,5.69 37.9,5.69 38.15,5.44 U18.6 38.15,2.77 38.66,2.26 41.84,2.26 42.09,2.51 R112.2 42.09,3.02 42.25,3.19 42.25,3.91
$5I3675\$1N3779: length 5.3
  Top Layer w0.254: D23.3 18.16,9.92 18.16,9.37 ; R114.1 R116.2 16.96,9.91
$5I3675\$1N3785: length 5.2
  Top Layer w0.254: 18.16,6.96 18.16,6.41 D24.3 ; 16.93,6.4 R118.2 R115.2
$5I3675\C: length 14.3
  Top Layer w0.381: 2.41,4.17 2.41,5.81 J6.3 3.65,7.09 9.71,7.09 10.72,8.1 D21.3
$5I3675\IN+: length 10.1
  Top Layer w0.254: 22.46,9.71 20.71,9.71 20.25,9.25 20.25,7.98 19.83,7.56 19.03,7.56 ; 19.48,5.6 19.03,6.06 19.03,7.56 ; 19.03,7.56 C110.1
$5I3675\IN-: length 7.6
  Top Layer w0.254: 16.18,8.65 19.03,8.65 19.03,9.37 19.03,10.28 C112.2 20.26,10.73 20.63,10.36 U17.2
$5I3675\L: length 7.9
  Top Layer w0.254: R118.1 14.28,7.27 14.02,7.01 14.02,6.07 13.77,5.82 13.52,5.82 13.5,5.83 12.88,5.83 ; D21.2 11.91,5.84 11.9,5.83
  Top Layer w0.381: 12.88,5.83 9.27,5.83
$5I3675\OUT1: length 8.9
  Top Layer w0.254: R101.2 27.74,9.7 27.72,9.71 ; 27.72,9.71 28.67,9.71 29.01,9.37 C102.1 ; 27.72,9.71 U17.6 25.11,9.71 24.49,10.34 R102.1
$5I3675\OUT1_HP: length 13.9
  Top Layer w0.254: R104.2 28.5,6.45 29.01,6.96 C102.2 29.05,7.72 30.15,7.72 30.73,8.3 30.73,8.94 31.3,9.5 34.85,9.5 36.17,10.82 37.97,10.82 38.15,10.64 U18.3
$5I3675\OUT2: length 7.5
  Top Layer w0.254: R108.2 39.88,12.85 40.69,12.04 ; 40.69,12.04 40.69,12.18 40.93,12.42 41.8,12.42 C99.1 ; 40.69,12.04 40.69,9.77
$5I3675\OUT2_HP: length 4.5
  Top Layer w0.254: C99.2 41.96,9.95 42.57,9.34 43.22,9.34 R103.2 44.59,9.32 R109.1
$5I3675\OUT3: length 11.1
  Top Layer w0.254: 43.23,4.55 43.23,3.15 ; 43.23,4.55 42.98,4.55 42.52,5 C108.2 ; 43.23,4.55 R113.1 ; 43.23,3.15 C106.2 ; 43.23,3.15 42.96,2.87 42.96,2.59 ; 42.13,5 42.11,4.98 41.56,4.98 41.38,4.8 41.38,2.9 41.2,2.72 39.6,2.72 39.42,2.9 U18.7
$5I3675\R: length 13
  Top Layer w0.254: D21.1 11.91,10.44 11.85,10.5 ; 12.88,10.5 13.53,10.5 13.9,10.13 13.9,9.25 14.08,9.07 14.64,9.07 R116.1
  Top Layer w0.381: 4.27,10.63 4.4,10.5 12.88,10.5
VREF: length 634
  Top Layer w0.254: U10.1 28.06,31.42 28.37,31.74 28.37,32.19 R64.1 ; R44.1 28.37,45.79 28.37,45.33 28.06,45.01 U7.1 ; U2.1 28.06,58.61 28.37,58.92 28.37,59.38 R17.1 ; R84.1 28.37,18.6 28.37,18.14 28.06,17.83 U13.1 ; 27.06,4.23 28.06,4.23 28.37,4.55 28.37,5 R104.1 ; U4.1 28.06,72.2 28.37,72.52 28.37,72.97 R4.1
  Top Layer w0.381: C74.1 v1(19.48,40.24) 19.22,40.51 18.29,40.51 18.02,40.24 18.02,38.47 17.75,38.2 15.67,38.2 15.41,38.47 15.41,39 15.07,39.34 14.6,39.34 ; 14.73,58.54 R37.2 ; 14.73,58.54 R35.1 ; 14.73,58.54 16.08,58.54 ; C17.1 v1(19.48,81.03) 19.22,81.3 18.29,81.3 18.02,81.03 D3.1 18.02,79.25 17.75,78.98 15.67,78.98 15.41,79.25 15.41,79.79 15.07,80.12 14.6,80.12 ; 14.73,72.14 R22.2 ; 14.73,72.14 16.08,72.14 ; 14.73,72.14 R20.1 ; 16.08,44.95 16.08,45.48 16.69,46.09 18.47,46.09 19.27,45.29 C54.2 19.9,45.29 20.25,45.63 v1(20.25,47.62) ; 16.08,44.95 14.73,44.95 ; 16.08,44.95 D12.1 ; 14.6,66.53 15.07,66.53 15.41,66.19 15.41,65.65 15.67,65.38 17.75,65.38 18.02,65.65 D7.1 18.02,67.43 18.29,67.7 19.22,67.7 v1(19.48,67.43) C36.1 ; 16.08,72.14 16.08,72.67 16.69,73.28 18.47,73.28 19.27,72.48 C16.2 19.9,72.48 20.25,72.82 v1(20.25,74.8) ; 16.08,72.14 D4.1 ; C55.1 v1(19.48,53.84) 19.22,54.11 18.29,54.11 18.02,53.84 D11.1 18.02,52.06 17.75,51.79 15.67,51.79 15.41,52.06 15.41,52.6 15.07,52.93 14.6,52.93 ; v1(20.25,34.02) 20.25,32.04 19.9,31.7 C73.2 19.27,31.7 18.47,32.5 16.69,32.5 16.08,31.89 16.08,31.35 ; 14.6,12.15 15.07,12.15 15.41,11.82 15.41,11.28 15.67,11.01 17.75,11.01 18.02,11.28 D23.1 18.02,13.06 18.29,13.33 19.22,13.33 v1(19.48,13.06) C112.1 ; 16.08,58.54 16.08,59.07 16.69,59.69 18.47,59.69 19.27,58.89 C35.2 19.9,58.89 20.25,59.23 v1(20.25,61.21) ; 16.08,58.54 D8.1 ; 14.73,31.35 R77.2 ; 14.73,31.35 16.08,31.35 ; 14.73,31.35 R75.1 ; 14.73,44.95 R55.1 ; 14.73,44.95 R57.2 ; 16.08,4.17 16.08,4.7 16.69,5.31 18.47,5.31 19.27,4.51 C111.2 19.9,4.51 20.25,4.85 v1(20.25,6.83) ; 16.08,4.17 14.73,4.17 ; 16.08,4.17 D24.1 ; 16.08,31.35 D16.1 ; 14.73,4.17 R117.2 ; 14.73,4.17 R115.1 ; v1(20.25,20.43) 20.25,18.45 19.9,18.1 19.27,18.1 18.47,18.9 16.69,18.9 16.08,18.29 16.08,17.76 ; D20.1 16.08,17.76 ; 16.08,17.76 14.73,17.76 ; 32.31,5.73 32.18,5.86 ; 32.31,46.51 32.18,46.64 ; R95.1 14.73,17.76 ; 14.73,17.76 R97.2 ; 32.31,73.7 32.18,73.83 ; 32.31,19.32 32.18,19.45 ; 32.31,32.92 32.18,33.05 ; C93.1 v1(19.48,26.65) 19.22,26.92 18.29,26.92 18.02,26.65 D19.1 18.02,24.87 17.75,24.6 15.67,24.6 15.41,24.87 15.41,25.41 15.07,25.75 14.6,25.75 ; 32.31,60.11 32.18,60.23
  Top Layer w0.508: v1(29.52,4.67) 29.52,3.21 29.08,2.77 ; U7.1 27.14,44.93 27.14,43.68 ; 32.18,5.6 32.18,5.73 ; 32.18,5.6 32.31,5.73 ; 32.18,5.6 32.18,3.61 ; 32.18,30.79 32.18,29.96 29.08,29.96 ; 32.18,30.79 32.18,32.79 ; 32.18,30.79 35.61,30.79 35.61,29.03 C69.1 ; U2.1 27.14,58.53 27.14,57.27 ; U4.1 27.14,72.12 27.14,70.87 ; C56.2 29.08,43.55 ; 29.08,43.55 32.18,43.55 32.18,44.39 ; 29.08,43.55 29.52,43.99 v1(29.52,45.46) ; C94.2 29.08,16.36 ; 29.08,16.36 29.52,16.8 v1(29.52,18.27) ; 29.08,16.36 32.18,16.36 32.18,17.2 ; C12.1 35.61,69.81 35.61,71.58 32.18,71.58 ; 19.07,57.4 19.1,57.44 19.1,57.83 19.48,58.21 C35.2 ; 27.14,16.49 27.14,17.75 U13.1 ; 32.18,44.39 32.18,46.39 ; 32.18,44.39 35.61,44.39 35.61,42.63 C50.1 ; 32.18,46.39 32.31,46.51 ; 32.18,46.39 32.18,46.51 ; 32.18,57.98 32.18,59.98 ; 32.18,57.98 35.61,57.98 35.61,56.22 C31.1 ; 32.18,57.98 32.18,57.15 29.08,57.15 ; 32.18,59.98 32.18,60.11 ; 32.18,59.98 32.31,60.11 ; 32.18,71.58 32.18,70.74 29.08,70.74 ; 32.18,71.58 32.18,73.57 ; v1(29.52,31.86) 29.52,30.4 29.08,29.96 ; 32.18,19.2 32.31,19.32 ; 32.18,19.2 32.18,17.2 ; 32.18,19.2 32.18,19.32 ; 29.08,29.96 C75.2 ; 49.76,52.82 49.68,52.74 44.29,52.74 v1(43.74,52.19) 43.23,51.68 R43.1 ; 32.18,33.05 R66.2 ; C54.2 19.48,44.62 19.1,44.24 19.1,43.84 19.07,43.81 ; R124.2 49.78,5.82 49.76,5.84 ; 29.08,2.77 32.18,2.77 32.18,3.61 ; 29.08,2.77 C113.2 ; 32.18,73.57 32.31,73.7 ; 32.18,73.57 32.18,73.7 ; R63.1 43.23,38.09 v1(43.74,38.59) 44.3,39.15 49.64,39.15 49.76,39.27 ; 49.76,66.23 49.67,66.33 44.29,66.33 v1(43.74,65.78) 43.23,65.27 R16.1 ; 32.18,17.2 35.61,17.2 35.61,15.44 C88.1 ; 29.08,70.74 29.52,71.18 v1(29.52,72.64) ; 29.08,70.74 C18.2 ; C107.1 35.61,1.84 35.61,3.61 32.18,3.61 ; R83.1 43.23,24.49 v1(43.74,25) 44.3,25.56 49.76,25.56 ; 32.18,32.79 32.18,32.92 ; 32.18,32.79 32.31,32.92 ; 55.37,59.98 55.75,59.98 56.66,59.07 U20.4 U20.3 ; v1(43.74,79.38) 43.23,78.87 R5.1 ; 32.18,73.83 R6.2 ; 19.07,30.21 19.1,30.25 19.1,30.64 19.48,31.03 C73.2 ; 27.14,2.9 27.14,4.15 27.06,4.23 ; 27.14,30.08 27.14,31.34 U10.1 ; 32.18,46.64 R46.2 ; 19.48,18.1 19.48,17.43 19.1,17.05 19.1,16.65 19.07,16.62 ; C16.2 19.48,71.81 19.1,71.43 19.1,71.03 19.07,70.99 ; C111.2 19.48,3.84 19.1,3.46 19.1,3.06 19.07,3.02 ; 29.08,57.15 29.52,57.59 v1(29.52,59.05) ; 29.08,57.15 C37.2 ; R103.1 43.23,10.9 v1(43.74,11.41) 43.74,11.53 44.4,12.19 48.1,12.19 48.13,12.22 ; 32.18,19.45 32.18,21.82 ; 32.18,60.23 R26.2 ; 32.18,5.86 R106.2
  Top Layer w0.762: v1(53.59,62.01) v1(54.47,62.01) 57.87,62.01 58.44,61.44 58.44,59.31 ; v1(43.74,79.38) 44.28,79.91 49.75,79.91 49.76,79.9 49.76,12.1 ; 48.13,12.18 49.68,12.18 49.76,12.1 ; 49.76,12.1 49.76,5.84
  Bottom Layer w0.508: v1(29.52,45.46) 22.41,45.46 v1(20.25,47.62) 19.48,48.38 v1(19.48,53.84) ; 32.18,46.98 32.18,46.51 ; v1(29.52,31.86) 22.41,31.86 v1(20.25,34.02) 19.48,34.78 v1(19.48,40.24) ; 32.18,60.57 32.18,60.11 ; R66.2 33.07,35.42 35.11,37.45 42.6,37.45 v1(43.74,38.59) ; 32.18,74.17 32.18,73.7 ; v1(43.74,79.38) 42.6,78.23 35.11,78.23 33.07,76.2 R6.2 ; v1(29.52,59.05) 22.41,59.05 v1(20.25,61.21) 19.48,61.97 v1(19.48,67.43) ; R86.2 33.07,21.82 35.11,23.86 42.6,23.86 v1(43.74,25) ; v1(29.52,4.67) 22.41,4.67 v1(20.25,6.83) 19.48,7.59 v1(19.48,13.06) ; v1(19.48,26.65) 19.48,21.19 v1(20.25,20.43) 22.41,18.27 v1(29.52,18.27) ; 32.18,33.39 32.18,32.92 ; v1(43.74,52.19) 42.6,51.04 35.11,51.04 33.07,49.01 R46.2 ; 32.18,19.79 32.18,19.32 ; v1(43.74,65.78) 42.6,64.64 35.11,64.64 33.07,62.61 R26.2 ; R106.2 33.07,8.23 35.11,10.26 42.6,10.26 v1(43.74,11.41) ; 32.18,6.2 32.18,5.73 ; v1(29.52,72.64) 22.41,72.64 v1(20.25,74.8) 19.48,75.57 v1(19.48,81.03)
  Bottom Layer w0.762: v1(53.59,62.01) v1(49.78,62.01) v1(49.78,61.09)
